# EAGLE board fmcboard_v1.6 (EAGLE 9.6.2), part 1 of 2
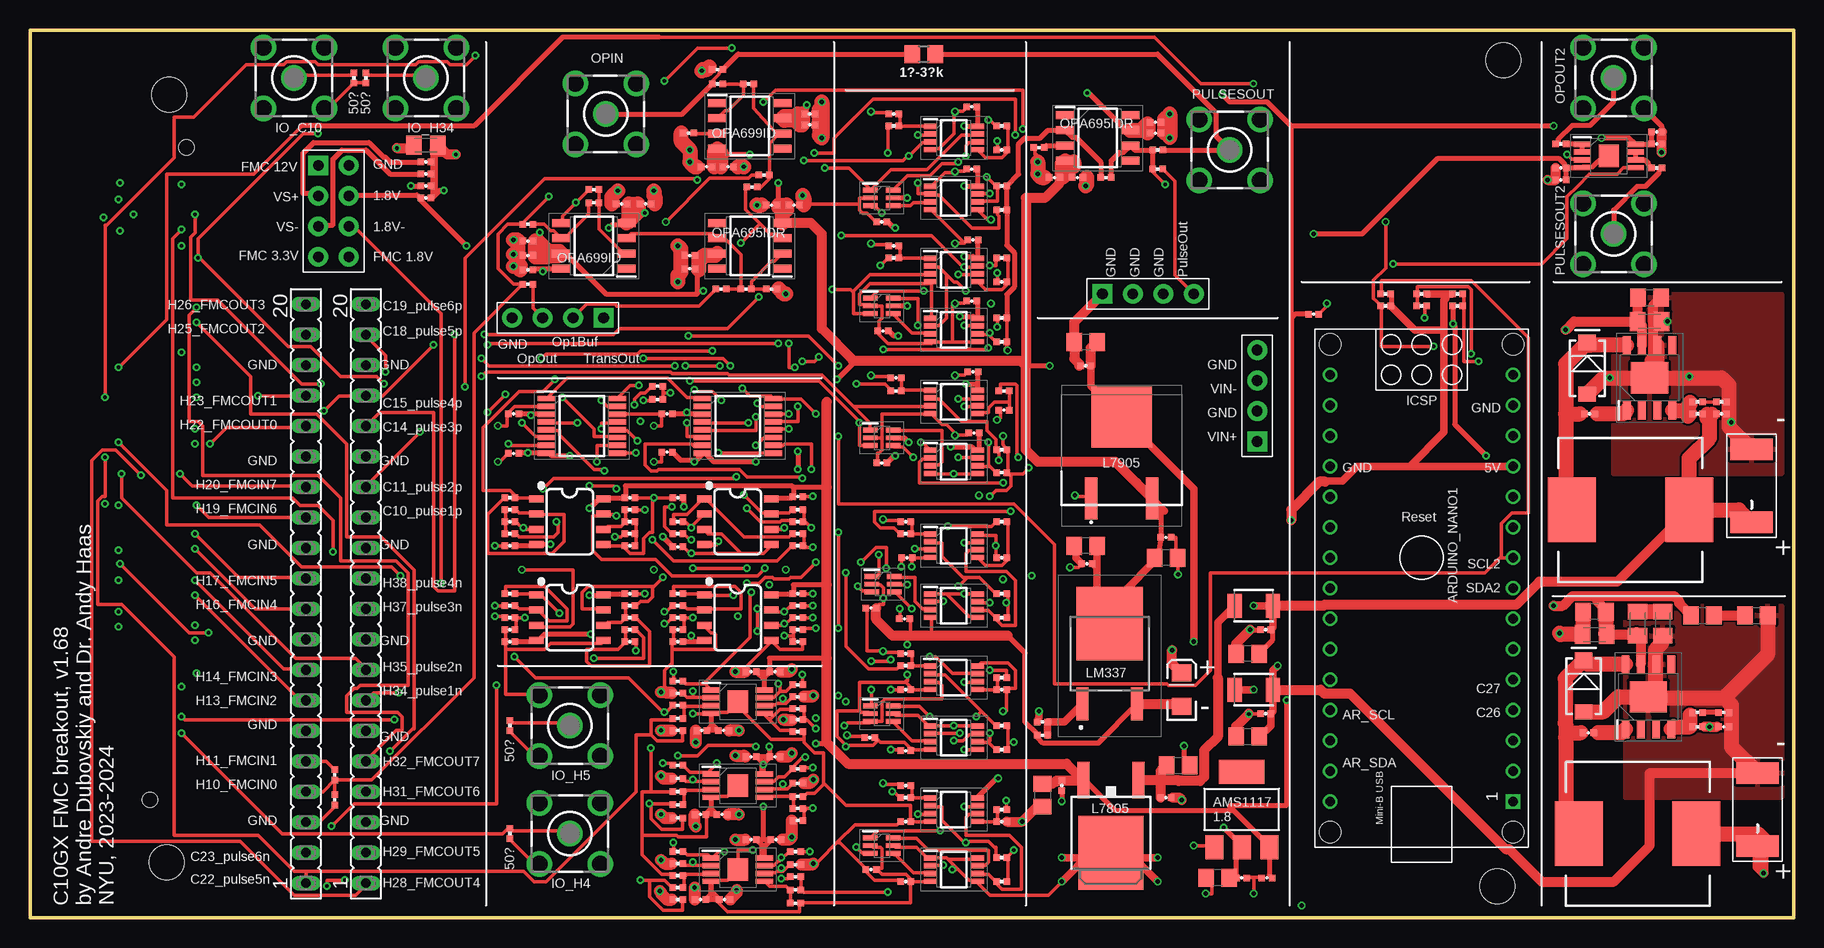
[diagram p5: board, top side]
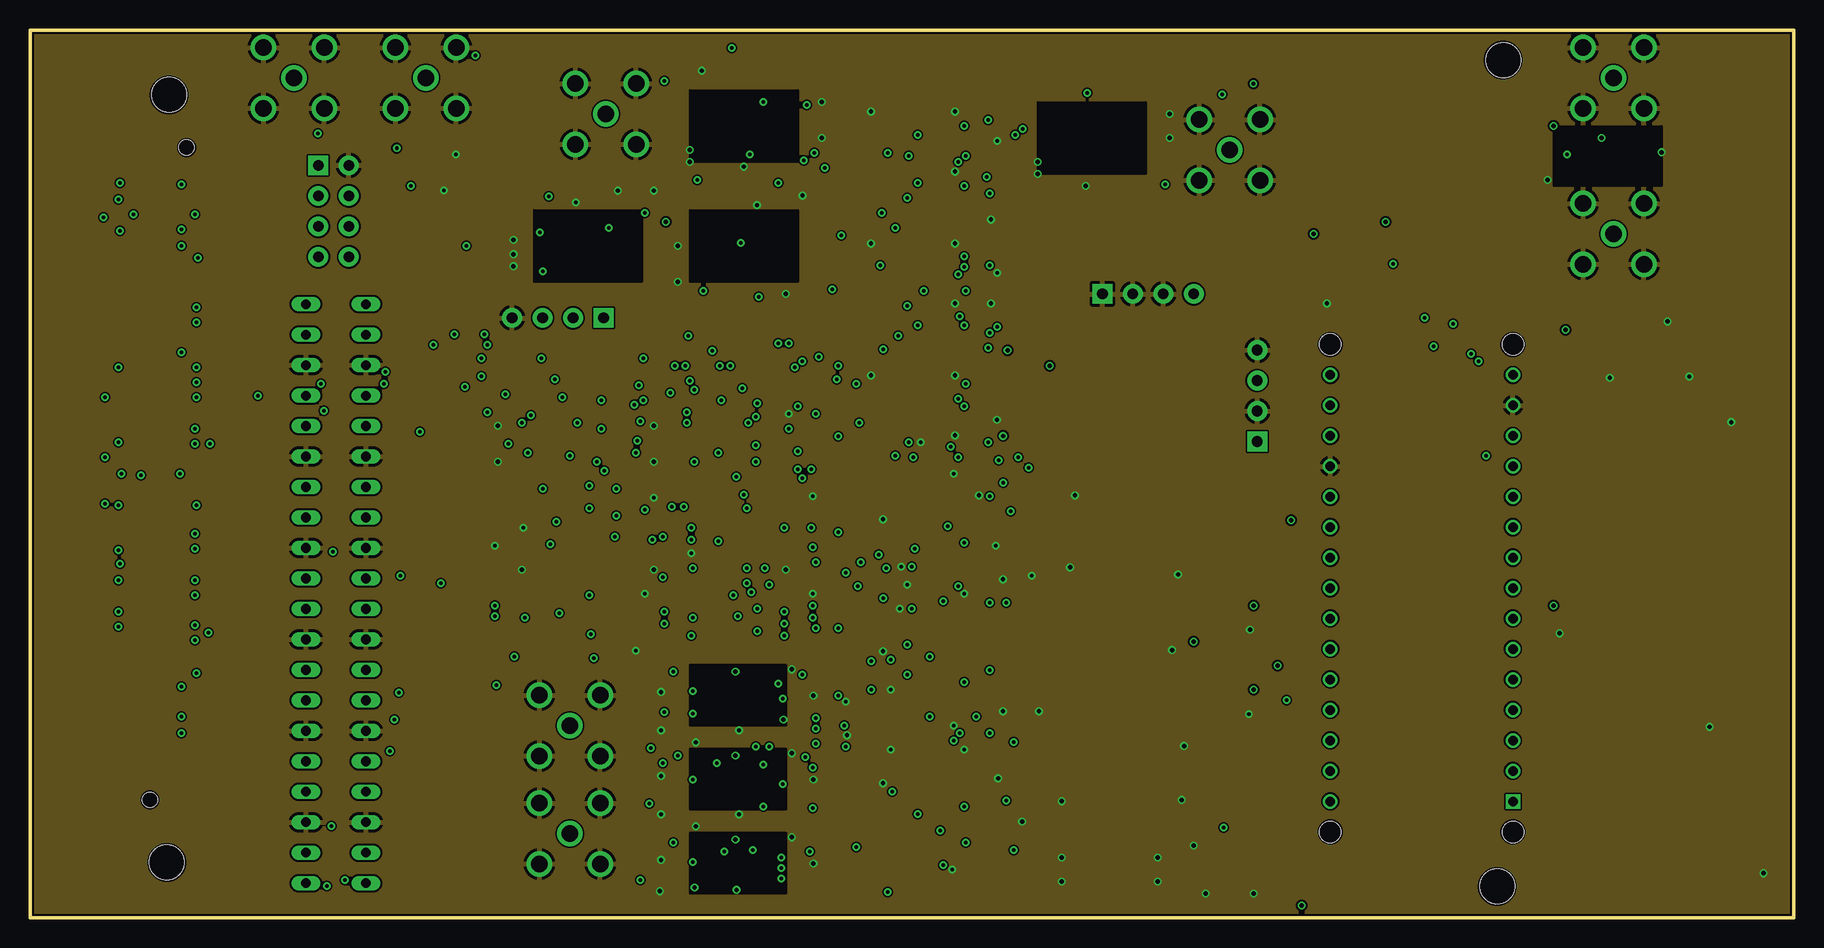
[diagram p6: board, inner layer topgnd]
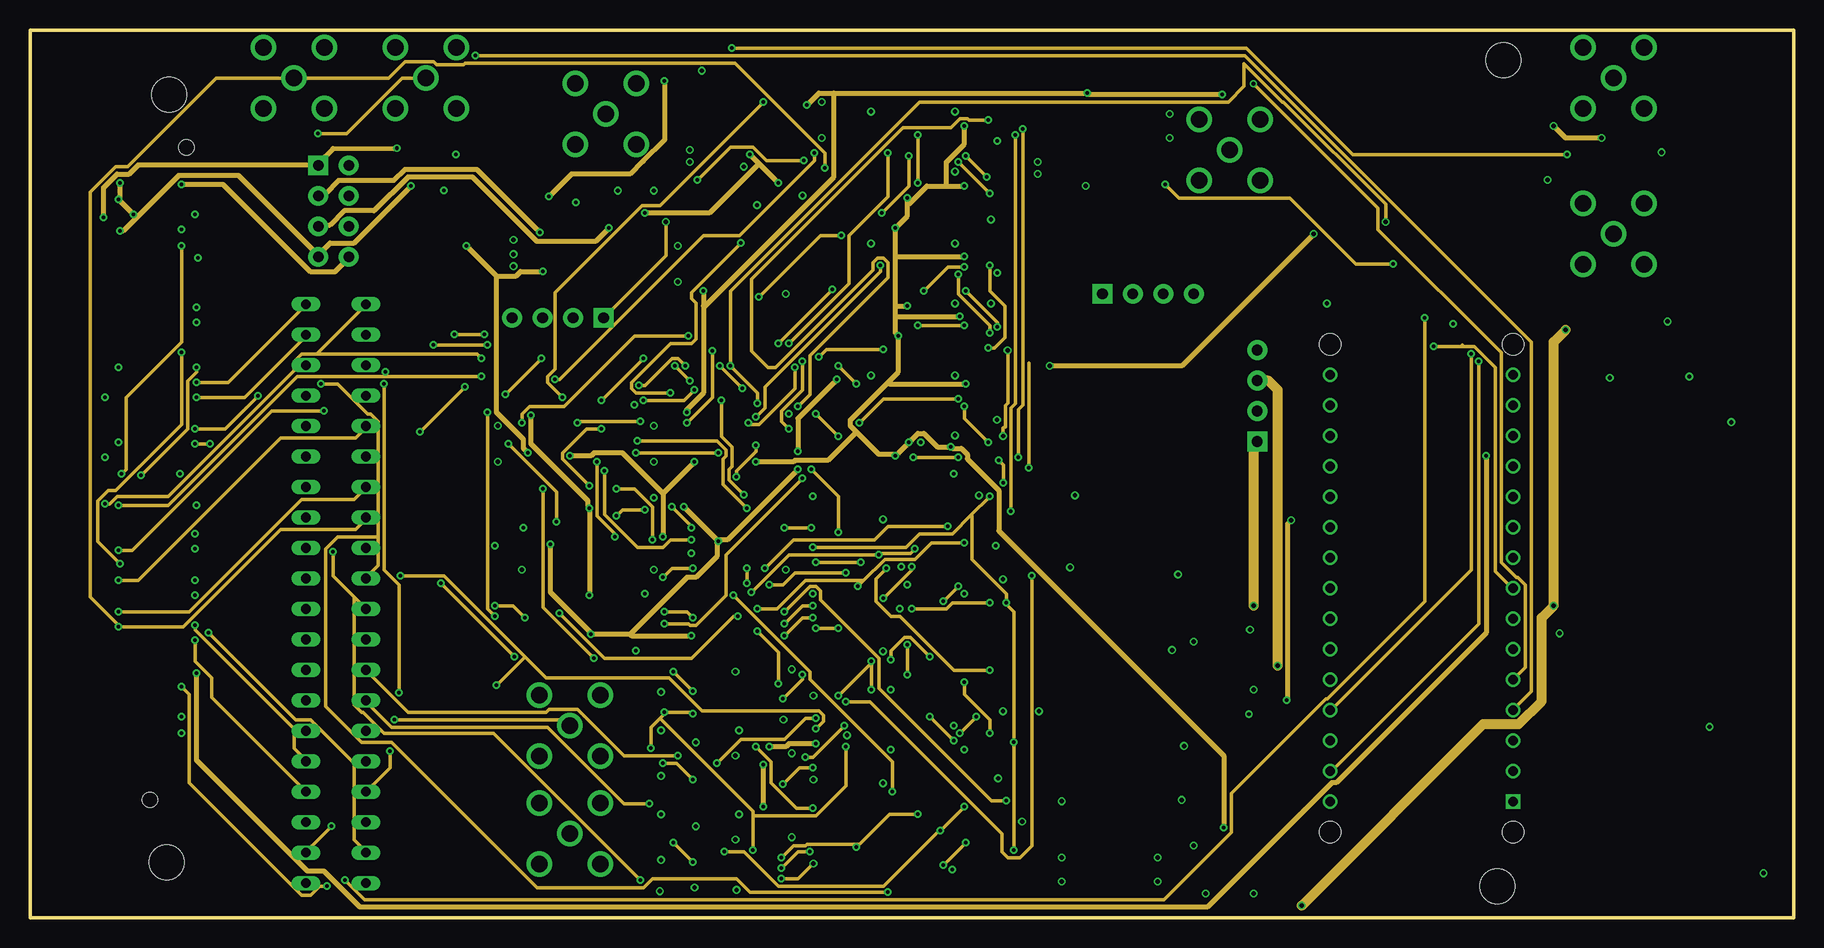
[diagram p7: board, inner layer route]
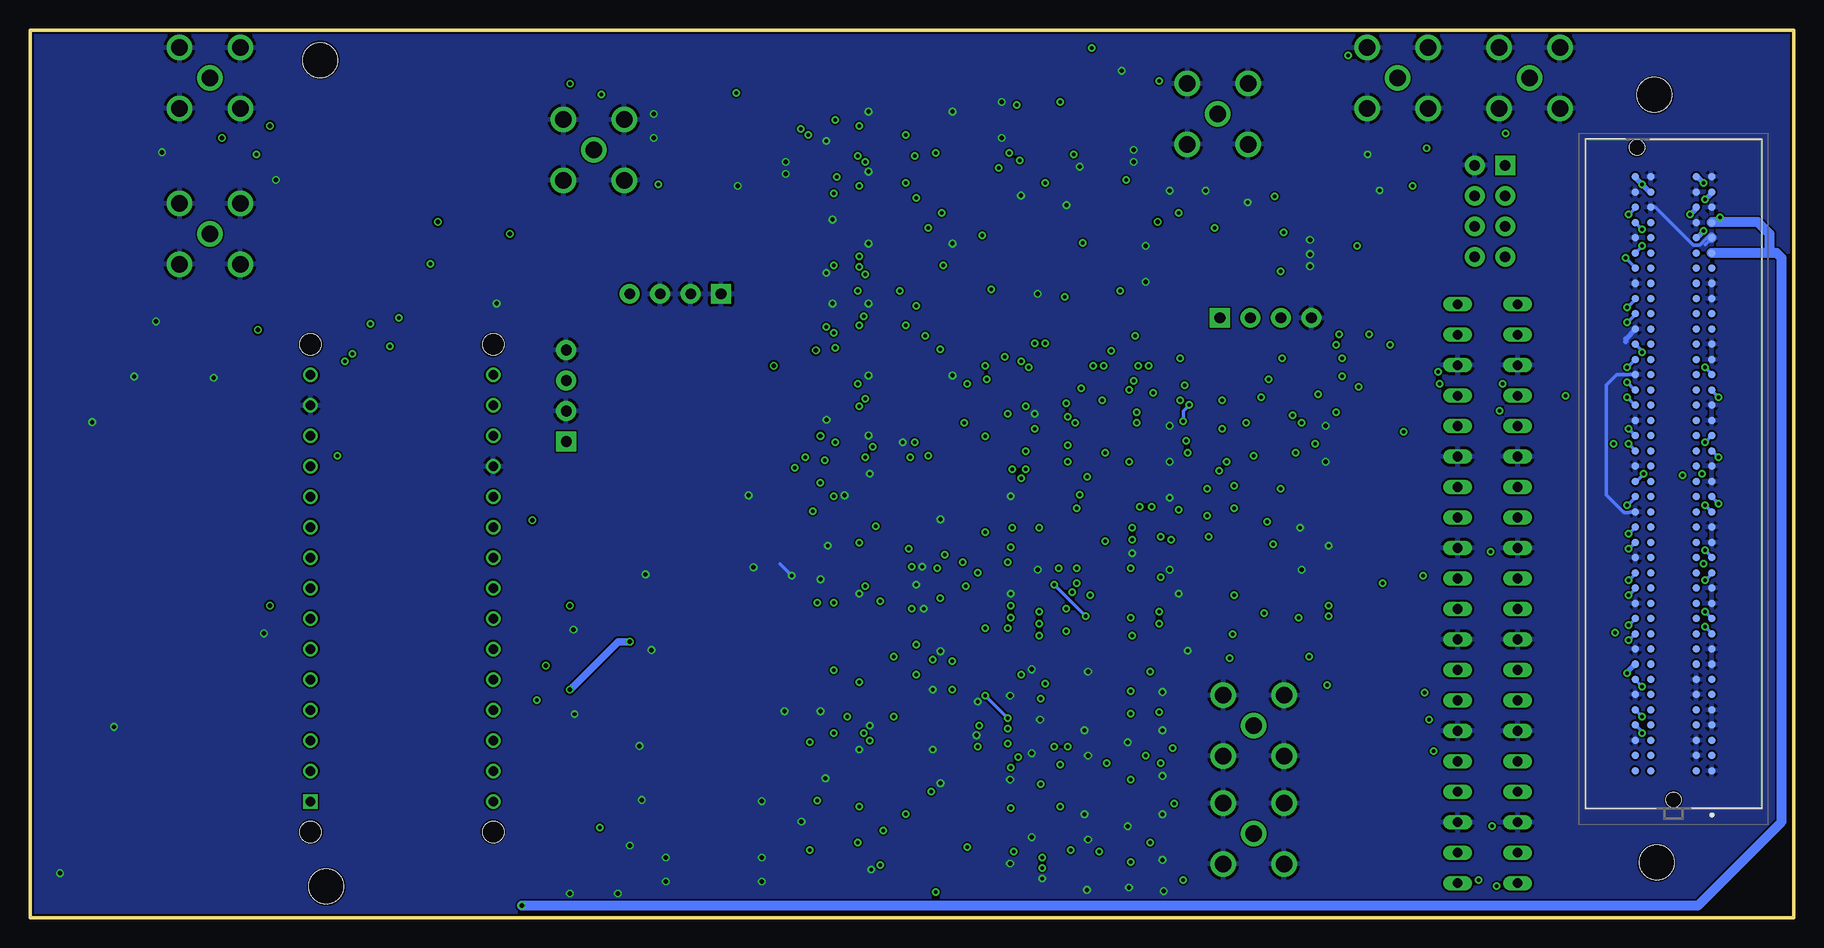
[diagram p8: board, bottom side, seen from below]

Size 147 x 74 mm. Coordinates in mm from the lower left corner, seen from the top.
Outline: 0,74 0,0 147,0 147,74 0,74
Copper layers (1*2*15*16): top 0.035mm / dielectric 0.2mm / topgnd 0.0175mm / dielectric 0.3mm / route 0.0175mm / dielectric 0.2mm / gnd 0.035mm
Design rules "Seeed_AllPCB_MacroFab_haas6mil *": minimum track width 6mil, minimum drill 12mil, track to track 6mil, track to pad 6mil, pad to pad 6mil, via to via 6mil, smd to smd 0mil, copper to edge 6mil, drill to drill 6mil, minimum pad ring 6mil, minimum via ring 6mil, stop-mask expansion 6mil, vias tented up to drill 25mil, thermal gap 10mil
Net classes: 0 default: width 0.305 mm; 1 power: width 0.406 mm; 2 gnd: width 0.305 mm
Holes 2.9 mm at 11.4,4.6 122.8,71.5 11.6,68.6 122.3,2.6

## Footprints (pad centres in the part's own frame; a part is rotated, then mirrored left to right if it is on the bottom)
ARDUINO_NANO = drill 0.8 square: 1 -20.32,-7.62 | drill 0.8: 2 -17.78,-7.62; 3 -15.24,-7.62; 4 -12.7,-7.62; 5 -10.16,-7.62; 6 -7.62,-7.62; 7 -5.08,-7.62; 8 -2.54,-7.62; 9 0,-7.62; 10 2.54,-7.62; 11 5.08,-7.62; 12 7.62,-7.62; 13 10.16,-7.62; 14 12.7,-7.62; 15 15.24,-7.62; 16 15.24,7.62; 17 12.7,7.62; 18 10.16,7.62; 19 7.62,7.62; 20 5.08,7.62; 21 2.54,7.62; 22 0,7.62; 23 -2.54,7.62; 24 -5.08,7.62; 25 -7.62,7.62; 26 -10.16,7.62; 27 -12.7,7.62; 28 -15.24,7.62; 29 -17.78,7.62; 30 -20.32,7.62 | hole 1.778: -22.86,-7.62; -22.86,7.62; 17.78,7.62; 17.78,-7.62
C0805 = smd 1.3 x 1.5: 1 -0.95,0; 2 0.95,0
VISHAY_C = smd 3.556 x 1.778: + 0,3.048; - 0,-3.048
0402_CAP = smd 0.536 x 0.546: 1 -0.433,0; 2 0.433,0
C0805K = smd 1.3 x 1.6: 1 -1,0; 2 1,0
EIA3216 = smd 1.4 x 1.6: A 1.4,0; C -1.4,0
SMA-DIODE = smd 1.27 x 1.47: A -2.15,0; C 2.15,0
SOIC127P600X175-8N = smd 1.528 x 0.65: 1 -2.711,1.905; 2 -2.711,0.635; 3 -2.711,-0.635; 4 -2.711,-1.905; 5 2.711,-1.905; 6 2.711,-0.635; 7 2.711,0.635; 8 2.711,1.905
SOP65P640X120-16N = smd 1.475 x 0.45: 1 -2.938,2.275; 2 -2.938,1.625; 3 -2.938,0.975; 4 -2.938,0.325; 5 -2.938,-0.325; 6 -2.938,-0.975; 7 -2.938,-1.625; 8 -2.938,-2.275; 9 2.938,-2.275; 10 2.938,-1.625; 11 2.938,-0.975; 12 2.938,-0.325; 13 2.938,0.325; 14 2.938,0.975; 15 2.938,1.625; 16 2.938,2.275
SOP65P490X110-9N = smd 1.425 x 0.45: 1 -2.212,0.975; 2 -2.212,0.325; 3 -2.212,-0.325; 4 -2.212,-0.975; 5 2.212,-0.975; 6 2.212,-0.325; 7 2.212,0.325; 8 2.212,0.975 | smd 1.68 x 1.88: 9 0,0
SO08 = smd 0.6 x 1.2: 1 -1.905,-2.8; 2 -0.635,-2.8; 3 0.635,-2.8; 4 1.905,-2.8; 5 1.905,2.8; 6 0.635,2.8; 7 -0.635,2.8; 8 -1.905,2.8
TO252 = smd 1 x 3.048: 1 -2.28,-3.556; 2 2.28,-3.556 | smd 5.4 x 6.2: 3 0,2.5
SOP65P400X130-8N = smd 1.1 x 0.45: 1 -1.95,0.975; 2 -1.95,0.325; 3 -1.95,-0.325; 4 -1.95,-0.975; 5 1.95,-0.975; 6 1.95,-0.325; 7 1.95,0.325; 8 1.95,0.975
SOT65P210X110-6N = smd 1.2 x 0.4: 1 -0.95,0.65; 2 -0.95,0; 3 -0.95,-0.65; 4 0.95,-0.65; 5 0.95,0; 6 0.95,0.65
MC7905ACD2TR4G = smd 1.016 x 3.504: 1 -2.54,-4.064; 3 2.54,-4.064 | smd 5.08 x 5.08: 2 0,2.745
SOT223 = smd 1.499 x 2.007: 1 -2.261,-3.15; 2 0.025,-3.15; 3 2.311,-3.15 | smd 3.81 x 2.007: 4 0,3.15
LM337KVURG3 = smd 1 x 2.75: 1 -2.29,-4.2; 3 2.29,-4.2 | smd 5.55 x 6.15: 2 0,2.5
SOIC127P600X170-9N = smd 1.525 x 0.65: 1 -2.712,1.905; 2 -2.712,0.635; 3 -2.712,-0.635; 4 -2.712,-1.905; 5 2.712,-1.905; 6 2.712,-0.635; 7 2.712,0.635; 8 2.712,1.905 | smd 2.6 x 3.1: 9 0,0
BU-SMB-V = drill 1.4: 1 0,0; 2 -2.54,2.54; 3 2.54,2.54; 4 2.54,-2.54; 5 -2.54,-2.54
H4-2.54 = drill 0.889 pad 1.651 square: 1 0,3.81 | drill 0.889 pad 1.651: 2 0,1.27; 3 0,-1.27; 4 0,-3.81
ASP13460401 = smd 0.64 x 0.64: C1 24.765,3.175; C2 23.495,3.175; C3 22.225,3.175; C4 20.955,3.175; C5 19.685,3.175; C6 18.415,3.175; C7 17.145,3.175; C8 15.875,3.175; C9 14.605,3.175; C10 13.335,3.175; C11 12.065,3.175; C12 10.795,3.175; C13 9.525,3.175; C14 8.255,3.175; C15 6.985,3.175; C16 5.715,3.175; C17 4.445,3.175; C18 3.175,3.175; C19 1.905,3.175; C20 0.635,3.175; C21 -0.635,3.175; C22 -1.905,3.175; C23 -3.175,3.175; C24 -4.445,3.175; C25 -5.715,3.175; C26 -6.985,3.175; C27 -8.255,3.175; C28 -9.525,3.175; C29 -10.795,3.175; C30 -12.065,3.175; C31 -13.335,3.175; C32 -14.605,3.175; C33 -15.875,3.175; C34 -17.145,3.175; C35 -18.415,3.175; C36 -19.685,3.175; C37 -20.955,3.175; C38 -22.225,3.175; C39 -23.495,3.175; C40 -24.765,3.175; D1 24.765,1.905; D2 23.495,1.905; D3 22.225,1.905; D4 20.955,1.905; D5 19.685,1.905; D6 18.415,1.905; D7 17.145,1.905; D8 15.875,1.905; D9 14.605,1.905; D10 13.335,1.905; D11 12.065,1.905; D12 10.795,1.905; D13 9.525,1.905; D14 8.255,1.905; D15 6.985,1.905; D16 5.715,1.905; D17 4.445,1.905; D18 3.175,1.905; D19 1.905,1.905; D20 0.635,1.905; D21 -0.635,1.905; D22 -1.905,1.905; D23 -3.175,1.905; D24 -4.445,1.905; D25 -5.715,1.905; D26 -6.985,1.905; D27 -8.255,1.905; D28 -9.525,1.905; D29 -10.795,1.905; D30 -12.065,1.905; D31 -13.335,1.905; D32 -14.605,1.905; D33 -15.875,1.905; D34 -17.145,1.905; D35 -18.415,1.905; D36 -19.685,1.905; D37 -20.955,1.905; D38 -22.225,1.905; D39 -23.495,1.905; D40 -24.765,1.905; G1 24.765,-1.905; G2 23.495,-1.905; G3 22.225,-1.905; G4 20.955,-1.905; G5 19.685,-1.905; G6 18.415,-1.905; G7 17.145,-1.905; G8 15.875,-1.905; G9 14.605,-1.905; G10 13.335,-1.905; G11 12.065,-1.905; G12 10.795,-1.905; G13 9.525,-1.905; G14 8.255,-1.905; G15 6.985,-1.905; G16 5.715,-1.905; G17 4.445,-1.905; G18 3.175,-1.905; G19 1.905,-1.905; G20 0.635,-1.905; G21 -0.635,-1.905; G22 -1.905,-1.905; G23 -3.175,-1.905; G24 -4.445,-1.905; G25 -5.715,-1.905; G26 -6.985,-1.905; G27 -8.255,-1.905; G28 -9.525,-1.905; G29 -10.795,-1.905; G30 -12.065,-1.905; G31 -13.335,-1.905; G32 -14.605,-1.905; G33 -15.875,-1.905; G34 -17.145,-1.905; G35 -18.415,-1.905; G36 -19.685,-1.905; G37 -20.955,-1.905; G38 -22.225,-1.905; G39 -23.495,-1.905; G40 -24.765,-1.905; H1 24.765,-3.175; H2 23.495,-3.175; H3 22.225,-3.175; H4 20.955,-3.175; H5 19.685,-3.175; H6 18.415,-3.175; H7 17.145,-3.175; H8 15.875,-3.175; H9 14.605,-3.175; H10 13.335,-3.175; H11 12.065,-3.175; H12 10.795,-3.175; H13 9.525,-3.175; H14 8.255,-3.175; H15 6.985,-3.175; H16 5.715,-3.175; H17 4.445,-3.175; H18 3.175,-3.175; H19 1.905,-3.175; H20 0.635,-3.175; H21 -0.635,-3.175; H22 -1.905,-3.175; H23 -3.175,-3.175; H24 -4.445,-3.175; H25 -5.715,-3.175; H26 -6.985,-3.175; H27 -8.255,-3.175; H28 -9.525,-3.175; H29 -10.795,-3.175; H30 -12.065,-3.175; H31 -13.335,-3.175; H32 -14.605,-3.175; H33 -15.875,-3.175; H34 -17.145,-3.175; H35 -18.415,-3.175; H36 -19.685,-3.175; H37 -20.955,-3.175; H38 -22.225,-3.175; H39 -23.495,-3.175; H40 -24.765,-3.175 | hole 1.27: 27.189,0; -27.191,-3.05
H2X4-2.54 = drill 0.889 pad 1.651 square: 1 -1.27,3.81 | drill 0.889 pad 1.651: 2 -1.27,1.27; 3 -1.27,-1.27; 4 -1.27,-3.81; 5 1.27,-3.81; 6 1.27,-1.27; 7 1.27,1.27; 8 1.27,3.81
1210 = smd 1.2 x 2: 1 -1.6,0; 2 1.6,0
CDRH125 = smd 5.4 x 4: 1 0,4.9; 2 0,-4.9
0402_RES = smd 0.536 x 0.546: 1 -0.433,0; 2 0.433,0
R0805 = smd 1.3 x 1.5: 1 -0.95,0; 2 0.95,0
FE20 = drill 0.813 long: 1 -24.13,0; 2 -21.59,0; 3 -19.05,0; 4 -16.51,0; 5 -13.97,0; 6 -11.43,0; 7 -8.89,0; 8 -6.35,0; 9 -3.81,0; 10 -1.27,0; 11 1.27,0; 12 3.81,0; 13 6.35,0; 14 8.89,0; 15 11.43,0; 16 13.97,0; 17 16.51,0; 18 19.05,0; 19 21.59,0; 20 24.13,0

## Placement (x,y rotation side)
ARDUINO_NANO1  1  [ARDUINO_NANO]  116,30 90 top
C1  10uF  [C0805]  101.5,22 180 top
C2  100uF  [VISHAY_C]  143.5,36 180 top
C3  0.1uF  [0402_CAP]  103.1,3.3 180 top
C4  0.1uF  [0402_CAP]  62.1,20.5 0 top
C5  0.1uF  [0402_CAP]  33,60 0 top
C6  0.1uF  [0402_CAP]  107,50.3 0 top
C7  0.1uF  [0402_CAP]  41.5,54 180 top
C8  0.1uF  [C0805K]  135,49.7 0 top
C9  0.1uF  [0402_CAP]  40.3,42 180 top
C10  0.1uF  [0402_CAP]  33,62 0 top
C11  0.1uF  [C0805K]  130.4,23.6 180 top
C12  0.1uF  [C0805K]  33,64.4 0 top
C13  0.1uF  [0402_CAP]  33,61 0 top
C14  0.1uF  [0402_CAP]  53.1,38.8 180 top
C15  0.1uF  [0402_CAP]  54,35 180 top
C16  0.1uF  [0402_CAP]  93.8,66.3 0 top
C17  1uF  [0402_CAP]  73,22 0 top
C18  1uF  [0402_CAP]  81,19 180 top
C19  1uF  [0402_CAP]  73,11 0 top
C20  1uF  [0402_CAP]  81,8 180 top
C21  0.1uF  [0402_CAP]  40,23 180 top
C22  0.1uF  [0402_CAP]  62.1,13.4 0 top
C23  0.1uF  [0402_CAP]  57.9,1.5 0 top
C24  0.1uF  [0402_CAP]  62.2,6.5 0 top
C25  0.1uF  [0402_CAP]  94.7,31.7 0 top
C26  0.1uF  [0402_CAP]  55,54.1 180 top
C27  0.1uF  [0402_CAP]  61.8,59.4 180 top
C28  0.1uF  [0402_CAP]  41.5,56.4 180 top
C29  0.1uF  [0402_CAP]  49.3,59.5 180 top
C30  0.1uF  [0402_CAP]  70.1,25.8 180 top
C31  1uF  [0402_CAP]  81.2,42.3 180 top
C32  100pF  [0402_CAP]  93.8,65.4 0 top
C33  0.1uF  [0402_CAP]  88.1,29.5 180 top
C34  10uF  [C0805]  99,3.3 180 top
C35  0.1uF  [0402_CAP]  78.5,67.6 180 top
C36  0.1uF  [0402_CAP]  54,30.9 0 top
C37  0.1uF  [0402_CAP]  50,27 0 top
C38  10uF  [C0805]  84.4,10.2 270 top
C39  10uF  [C0805]  94.7,30 180 top
C40  100uF  [VISHAY_C]  144,9 180 top
C41  10uF  [C0805]  101.5,15.1 0 top
C42  0.1uF  [0402_CAP]  103,24 180 top
C43  0.1uF  [0402_CAP]  94.7,10 0 top
C44  0.1uF  [0402_CAP]  103,17 0 top
C45  0.1uF  [0402_CAP]  88,46 0 top
C46  0.1uF  [0402_CAP]  87.3,61.7 180 top
C47  0.1uF  [0402_CAP]  86,11 270 top
C48  0.1uF  [0402_CAP]  64,35.1 0 top
C49  0.1uF  [0402_CAP]  71.1,48.9 180 top
C50  0.1uF  [0402_CAP]  73,3 180 top
C51  0.1uF  [0402_CAP]  73,8 180 top
C52  0.1uF  [0402_CAP]  78.5,62.4 180 top
C53  0.1uF  [0402_CAP]  78.6,56.5 180 top
C54  0.1uF  [0402_CAP]  53.1,42 180 top
C55  0.1uF  [0402_CAP]  40.3,38.7 180 top
C56  1uF  [0402_CAP]  54,24 0 top
C57  1uF  [0402_CAP]  40,24 0 top
C58  1uF  [0402_CAP]  72,56 0 top
C59  1uF  [0402_CAP]  72,67 0 top
C60  1uF  [0402_CAP]  64,23 0 top
C61  1uF  [0402_CAP]  50,23 0 top
C62  1uF  [0402_CAP]  81,53 180 top
C63  1uF  [0402_CAP]  81,64 180 top
C64  10uF  [C0805]  135,51.7 0 top
C65  0.1uF  [0402_CAP]  135.6,65.5 0 top
C66  0.1uF  [0402_CAP]  73,13.9 180 top
C67  0.1uF  [0402_CAP]  73,19 180 top
C68  0.1uF  [0402_CAP]  71,58 180 top
C69  0.1uF  [0402_CAP]  78.5,51.4 180 top
C70  0.1uF  [0402_CAP]  70.1,4 180 top
C71  0.1uF  [0402_CAP]  70,15 180 top
C72  0.1uF  [0402_CAP]  55.9,8.6 180 top
C73  0.1uF  [0402_CAP]  64,27 0 top
C74  0.1uF  [0402_CAP]  101,3.3 0 top
C75  0.1uF  [0402_CAP]  33,63 0 top
C76  0.1uF  [0402_CAP]  54,23 180 top
C77  10uF  [C0805]  88,31 180 top
C78  0.1uF  [0402_CAP]  65,67 0 top
C79  0.1uF  [0402_CAP]  58.2,62.6 0 top
C80  10uF  [C0805]  130.4,25.5 180 top
C81  100pF  [0402_CAP]  63.7,59.4 0 top
C82  100pF  [0402_CAP]  55,55.2 180 top
C83  100pF  [0402_CAP]  56.4,62.6 180 top
C84  100pF  [0402_CAP]  65,66.1 0 top
C85  100pF  [0402_CAP]  85.4,61.7 180 top
C86  0.1uF  [0402_CAP]  127.6,61.5 180 top
C87  100pF  [0402_CAP]  41.5,55.2 180 top
C88  100pF  [0402_CAP]  51.3,59.5 0 top
C89  1uF  [0402_CAP]  50,31 180 top
C90  1uF  [0402_CAP]  72.2,45 180 top
C91  100pF  [0402_CAP]  60.1,6.5 180 top
C92  100pF  [0402_CAP]  55.9,1.5 180 top
C93  100pF  [0402_CAP]  60.1,13.4 180 top
C94  100pF  [0402_CAP]  57.7,8.6 0 top
C95  0.1uF  [0402_CAP]  57.8,15.6 0 top
C96  1uF  [0402_CAP]  40,33 0 top
C97  0.1uF  [0402_CAP]  50,35 0 top
C98  0.1uF  [0402_CAP]  40,31 180 top
C99  1uF  [0402_CAP]  73,33 0 top
C100  1uF  [0402_CAP]  81,30 0 top
C101  0.1uF  [0402_CAP]  73.1,30 180 top
C102  0.1uF  [0402_CAP]  78.6,45.5 180 top
C103  0.1uF  [0402_CAP]  78.7,40.4 180 top
C104  0.1uF  [0402_CAP]  72.9,24.9 180 top
C105  0.1uF  [0402_CAP]  71,37.9 180 top
C106  0.1uF  [0402_CAP]  141.2,15.9 0 top
C107  0.01uF  [0402_CAP]  129.9,15.4 180 top
C108  0.1uF  [C0805K]  134,24.5 90 top
C109  10uF  [C0805]  143.9,25.2 0 top
C110  10uF  [C0805]  95.7,12.7 0 top
C111  10uF  [C0805]  88,48 0 top
C112  10uF  [C0805]  139.4,25.2 0 top
C113  0.1uF  [C0805K]  136.1,24.5 270 top
C114  100pF  [0402_CAP]  135.6,64.5 0 top
C115  100pF  [0402_CAP]  127.6,62.5 180 top
C116  100pF  [0402_CAP]  60.1,20.5 180 top
C117  100pF  [0402_CAP]  56,15.6 180 top
C121  0.1uF  [0402_CAP]  141,42 0 top
C122  0.01uF  [0402_CAP]  130,42 180 top
C125  2.2uF  [EIA3216]  96,19 90 top
D1  B340A  [SMA-DIODE]  129.8,45.8 90 top
D2  B340A  [SMA-DIODE]  129.5,19.3 90 top
IC1  OPA699ID  [SOIC127P600X175-8N]  60,66 0 top
IC2  DAC7578SPWR  [SOP65P640X120-16N]  59,41 0 top
IC3  LTC6229IMS8E#TRPBF  [SOP65P490X110-9N]  59,11 0 top
IC4  OPA695IDR  [SOIC127P600X175-8N]  89,65 0 top
IC5  LTC6229IMS8E#TRPBF  [SOP65P490X110-9N]  59,4 0 top
IC6  OPA695IDR  [SOIC127P600X175-8N]  60,56 180 top
IC7  OPA699ID  [SOIC127P600X175-8N]  47,56 180 top
IC8  LM358  [SO08]  45,25 270 top
IC9  LM358  [SO08]  59,25 270 top
IC10  LM358  [SO08]  59,33 270 top
IC11  7805DT  [TO252]  90.1,7.9 180 top
IC12  SN74AUC2G66DCTR  [SOP65P400X130-8N]  77,65 0 top
IC13  SN74AUC2G66DCTR  [SOP65P400X130-8N]  77,54 0 top
IC14  SN74AUC2G66DCTR  [SOP65P400X130-8N]  77,20 0 top
IC15  SN74AUC2G66DCTR  [SOP65P400X130-8N]  77,9 0 top
IC16  DAC7578SPWR  [SOP65P640X120-16N]  46,41 0 top
IC17  SN74AUC2G66DCTR  [SOP65P400X130-8N]  77,60 0 top
IC18  SN74AUC2G66DCTR  [SOP65P400X130-8N]  77,49 0 top
IC19  SN74AUC2G66DCTR  [SOP65P400X130-8N]  77,15 0 top
IC20  SN74AUC2G66DCTR  [SOP65P400X130-8N]  77,4 0 top
IC21  74AUP2GU04GW  [SOT65P210X110-6N]  71,60 0 top
IC22  74AUP2GU04GW  [SOT65P210X110-6N]  71,17 0 top
IC23  74AUP2GU04GW  [SOT65P210X110-6N]  71,51 0 top
IC24  74AUP2GU04GW  [SOT65P210X110-6N]  71,6 0 top
IC25  MC7905ACD2TR4G  [MC7905ACD2TR4G]  91,39 0 top
IC26  AMS1117-1.8  [SOT223]  101,9 0 top
IC27  LM358  [SO08]  45,33 270 top
IC28  SN74AUC2G66DCTR  [SOP65P400X130-8N]  77,31 0 top
IC29  LM337KVURG3  [LM337KVURG3]  90,22 0 top
IC30  SN74AUC2G66DCTR  [SOP65P400X130-8N]  77,43 0 top
IC31  SN74AUC2G66DCTR  [SOP65P400X130-8N]  77,38 0 top
IC32  SN74AUC2G66DCTR  [SOP65P400X130-8N]  77,26 0 top
IC33  LTC6229IMS8E#TRPBF  [SOP65P490X110-9N]  59,18 0 top
IC34  74AUP2GU04GW  [SOT65P210X110-6N]  71,40 0 top
IC35  74AUP2GU04GW  [SOT65P210X110-6N]  71.1,27.8 0 top
IC36  TPS5430DDAR  [SOIC127P600X170-9N]  134.9,18.4 90 top
IC37  TPS5430DDAR  [SOIC127P600X170-9N]  135,45 90 top
IC38  LTC6229IMS8E#TRPBF  [SOP65P490X110-9N]  131.6,63.5 0 top
IO_C10  BU-SMB-V  [BU-SMB-V]  22,70 270 top
IO_H4  BU-SMB-V  [BU-SMB-V]  45,7 270 top
IO_H5  BU-SMB-V  [BU-SMB-V]  45,16 270 top
IO_H34  BU-SMB-V  [BU-SMB-V]  33,70 270 top
J1  4p-2.54  [H4-2.54]  102.3,43.5 180 top
J2  ASP-134604-01  [ASP13460401]  10,37 270 bottom
J3  2X4P-2.54  [H2X4-2.54]  25.3,58.9 0 top
J5  4p-2.54  [H4-2.54]  44,50 270 top
J13  4p-2.54  [H4-2.54]  93.2,52 90 top
L1  10uH  [1210]  102,26 180 top
L2  10uH  [1210]  102,19 180 top
L3  10uH  [CDRH125]  133.4,34 90 top
L4  10uH  [CDRH125]  134,7 90 top
OPIN  BU-SMB-V  [BU-SMB-V]  48,67 90 top
OPOUT2  BU-SMB-V  [BU-SMB-V]  132,70 0 top
PULSESOUT  BU-SMB-V  [BU-SMB-V]  100,64 0 top
PULSESOUT2  BU-SMB-V  [BU-SMB-V]  132,57 0 top
R1  470  [0402_RES]  89.7,61.7 0 top
R2  47  [0402_RES]  57.3,69.5 180 top
R3  10  [0402_RES]  54.9,65.4 180 top
R4  50?  [0402_RES]  27,70 90 top
R5  50?  [0402_RES]  28,70 90 top
R6  1k  [0402_RES]  47,59.6 180 top
R7  470  [0402_RES]  81,59 180 top
R8  470  [0402_RES]  81,50 180 top
R9  1?-3?k  [R0805]  74.5,72 0 top
R10  100  [0402_RES]  25.4,9.8 90 top
R11  1k  [0402_RES]  59.9,69.5 180 top
R12  470  [0402_RES]  81,16 180 top
R13  10  [0402_RES]  84.1,64.2 180 top
R14  100  [0402_RES]  84.4,15.2 0 top
R15  50?  [0402_RES]  40,7 90 top
R16  50?  [0402_RES]  40,16 90 top
R17  1k  [0402_RES]  64,33 180 top
R18  1k  [0402_RES]  59.7,52.4 180 top
R19  47  [0402_RES]  61.8,52.4 180 top
R20  47  [0402_RES]  60.2,60.9 0 top
R21  330  [0402_RES]  54,9.4 180 top
R22  330  [0402_RES]  54,10.5 180 top
R23  330  [0402_RES]  54,12.7 180 top
R24  330  [0402_RES]  54,11.6 180 top
R25  330  [0402_RES]  52.3,43.2 180 top
R26  100  [0402_RES]  47,60.7 0 top
R27  330  [0402_RES]  64,9.1 180 top
R28  330  [0402_RES]  64,10.1 180 top
R29  330  [0402_RES]  64,12.4 180 top
R30  330  [0402_RES]  64,11.2 180 top
R31  330  [0402_RES]  52.3,44.3 180 top
R32  470  [0402_RES]  81,5 180 top
R33  470  [0402_RES]  81,61 180 top
R34  47  [0402_RES]  94,64 0 top
R35  1k  [0402_RES]  54,33 180 top
R36  470  [0402_RES]  81,48 180 top
R37  330  [0402_RES]  54,2.5 180 top
R38  470  [0402_RES]  81,14 180 top
R39  330  [0402_RES]  54,3.5 180 top
R40  470  [0402_RES]  81,3 180 top
R41  330  [0402_RES]  54,5.5 180 top
R42  100  [0402_RES]  57.3,70.7 180 top
R43  330  [0402_RES]  54,4.5 180 top
R44  330  [0402_RES]  63.8,2.3 180 top
R45  330  [0402_RES]  63.8,1.2 180 top
R46  330  [0402_RES]  63.8,5.5 180 top
R47  100  [0402_RES]  72,66 0 top
R48  4.7k  [0402_RES]  113,51 180 top
R49  4.7k  [0402_RES]  113,52 180 top
R50  4.7k  [0402_RES]  119,52 0 top
R51  4.7k  [0402_RES]  116,52 180 top
R52  330  [0402_RES]  63.8,4.4 180 top
R53  100  [0402_RES]  72,55 0 top
R54  100  [0402_RES]  40,25 0 top
R55  100  [0402_RES]  54,25 0 top
R56  100  [0402_RES]  81,66 180 top
R57  100  [0402_RES]  81,55 180 top
R58  100  [0402_RES]  50,24 0 top
R59  100  [0402_RES]  64,24 0 top
R60  1k  [0402_RES]  139,43 180 top
R61  1k  [0402_RES]  54,32 0 top
R62  1k  [0402_RES]  50,26 0 top
R63  1k  [0402_RES]  40,27 0 top
R64  1k  [0402_RES]  40,26 180 top
R65  1k  [0402_RES]  50,25 0 top
R66  1k  [0402_RES]  64,26 180 top
R67  1k  [0402_RES]  54,27 0 top
R68  1k  [0402_RES]  54,26 180 top
R69  1k  [0402_RES]  64,25 0 top
R70  47  [0402_RES]  84.4,16.3 180 top
R71  10  [0402_RES]  94,62.4 180 top
R72  10  [0402_RES]  57.6,52.4 0 top
R73  10k  [0402_RES]  139,42 0 top
R74  100  [0402_RES]  73,21 180 top
R75  100  [0402_RES]  81,20 0 top
R76  100  [0402_RES]  73,10 180 top
R77  100  [0402_RES]  81,9 0 top
R78  10  [0402_RES]  25.4,11.9 270 top
R79  1k  [0402_RES]  64,31 180 top
R80  330  [0402_RES]  54,8.3 180 top
R81  330  [0402_RES]  64,8.1 180 top
R82  330  [0402_RES]  63.8,3.4 180 top
R83  330  [0402_RES]  54,1.5 180 top
R84  1k  [0402_RES]  141,43 180 top
R85  1k  [0402_RES]  64,32 180 top
R86  10  [0402_RES]  41.5,52.8 180 top
R87  4.7k  [0402_RES]  119,51 0 top
R88  10  [0402_RES]  41.5,57.8 0 top
R89  10  [0402_RES]  61.2,61.9 0 top
R90  4.7k  [0402_RES]  116,51 180 top
R91  330  [0402_RES]  54,16.6 180 top
R92  100  [0402_RES]  81.2,43.9 180 top
R93  100  [0402_RES]  50,32 180 top
R94  100  [0402_RES]  72.2,43.9 180 top
R95  100  [0402_RES]  40,32 0 top
R96  1k  [0402_RES]  50,34 0 top
R97  1k  [0402_RES]  40,35 0 top
R98  1k  [0402_RES]  40,34 180 top
R99  1k  [0402_RES]  50,33 0 top
R100  100  [0402_RES]  73,32 180 top
R101  100  [0402_RES]  81,33 180 top
R102  330  [0402_RES]  54,17.7 180 top
R103  330  [0402_RES]  54,19.7 180 top
R104  330  [0402_RES]  54,18.7 180 top
R105  330  [0402_RES]  64,17.4 180 top
R106  330  [0402_RES]  64,15.5 180 top
R107  330  [0402_RES]  64,19.4 180 top
R108  330  [0402_RES]  64,18.4 180 top
R109  330  [0402_RES]  54,15.6 180 top
R110  330  [0402_RES]  64,16.5 180 top
R111  470  [0402_RES]  81,39 180 top
R112  470  [0402_RES]  81,27 180 top
R113  470  [0402_RES]  81,37.1 180 top
R114  470  [0402_RES]  81,25 180 top
R115  1k  [0402_RES]  64,34 180 top
R116  1k  [0402_RES]  139,17.1 180 top
R117  1k  [0402_RES]  141.2,17.1 180 top
R118  10k  [0402_RES]  139,15.9 0 top
R119  47  [0402_RES]  127.6,64.5 180 top
R120  47  [0402_RES]  135.6,62.5 180 top
SV1  20  [FE20]  23,27 90 top
SV2  20  [FE20]  28,27 90 top

## Tracks (layer width: path | path; a pad name or v marks a point on that pad's centre or on a via)
1V8  (via drill 0.3)
  top 0.406: C7.1 42.03,54.09 42.75,54.09 | 42.75,54.09 IC7.8 | C34.1 C74.1 100.57,5.39 IC26.2 101,6 v99.5,7.5 | v42.75,53.88 42.75,54.09 | v36.38,56 32.5,59.88 C5.1 32.5,60 32.25,60.25 26.65,60.25 J3.7 | C55.1 40.75,38.75 v41.5,38.75 43,38.75 IC16.8 43.25,38.75 43.5,38.5 v45,38.5 | v52.75,31.75 53.5,31 C36.1 | C14.1 53.62,38.75 54.25,38.12 55.25,38.12 v55.38,38 56,38.62 IC2.8 56.25,38.75 57,38 v60.5,38 | C35.1 79,67.5 79,66 IC12.8 78.75,66 v77.88,66 | C53.1 79,56.5 79,55 IC13.8 78.75,55 78.62,55.12 v77.88,55.12 | 79,44.5 79,44 IC30.8 | 79,44.5 79,45.5 C102.1 | C52.1 79,62.38 79,61 IC17.8 78.75,61 v77.88,61 | C69.1 79,51.38 79,50 IC18.8 78.75,50 78.62,50.12 v77.5,50.12 | C103.1 79.12,40.38 79.12,39 79,39 IC31.8 78.75,39 78.5,39.25 v76.75,39.25 | v72.12,38.5 72,38.5 71.5,38 C105.1 | v73.25,39.62 72.88,40 IC34.5 | v72.38,48.5 72,48.5 71.62,48.88 C49.1 | v72.12,57.5 72,57.5 71.5,58 C68.1 | v73.12,51 IC23.5 | v73.12,60 IC21.5 | v78,44.5 79,44.5
  route 0.406: v42.75,53.88 40.88,53.88 40.5,53.5 38.88,53.5 | v36.38,56 38.88,53.5 | 52.75,35.38 v52.75,31.75 | v55.38,38 52.75,35.38 | v45,38.5 46.75,38.5 47,38.75 49.38,38.75 52.75,35.38 | 71.5,44.62 68.38,41.5 68.38,41 68.88,40.5 | 71.5,44.62 72.38,45.5 v72.38,48.5 72.12,48.75 72.12,50.12 | 68.88,40.5 70.75,38.62 72,38.62 v72.12,38.5 v73.25,39.62 74,40.38 74.5,40.38 75.62,39.25 v76.75,39.25 76.88,39.12 77.62,39.12 78.12,38.62 78.12,38.25 80.75,35.62 80.75,32.25 99.5,13.5 v99.5,7.5 | 72.12,50.12 72.12,51 | 72.12,51 72.12,55.12 | 72.12,55.12 v72.12,57.5 73.12,58.5 73.12,59.5 | 72.12,51 v73.12,51 | 73.12,59.5 v73.12,60 | 72.12,50.12 v77.5,50.12 | 76.38,61 74.75,61 73.25,59.5 73.12,59.5 | 76.38,61 v77.88,61 | v78,44.5 71.62,44.5 71.5,44.62 | 72.12,55.12 v77.88,55.12 | v77.88,66 77.88,64.5 76.38,63 76.38,61 | v60.5,38 63.62,38 63.75,38.12 66.5,38.12 68.88,40.5 | 38.88,53.5 38.88,42.12 41.12,39.88 41.12,39.12 v41.5,38.75
1V8-  (via drill 0.3)
  top 0.305: IC28.4 75,30 C101.1 73.5,29.88 v73.5,29.25 | 73.38,23.5 73.38,24.88 C104.1 | 75.12,23.5 75.12,25 IC32.4 | IC35.2 70.25,27.75 70.88,27.75 71.12,27.5 v71.12,26.62 71.12,26.12 70.75,26.12 C30.1 | IC19.4 75,14 73.5,14 C66.1 73.5,14.12 73.38,14.12 72.88,14.62 70.88,14.62 70.5,15 C71.1 70.62,14.75 70.25,14.38 68,14.38 | IC14.4 75,19 C67.1 73.5,19.12 73,19.62 | 69.12,17.25 69.25,17.12 69.88,17.12 70,17 IC22.2 | 69.12,17.25 69.12,19.62 73,19.62 | 68,14.38 67.25,15.12 67.25,17.25 69.12,17.25 | v73.12,20.25 73.12,19.75 73,19.75 73,19.62 | v73.12,22.75 73.12,23.5 | C50.1 75,3 IC20.4 | C50.1 73.5,3.12 73,3.62 71,3.62 70.62,4 C70.1 70.62,4.12 71,4.12 71,5.75 70.88,5.88 70.25,5.88 70.12,6 IC24.2 | C23.1 57.25,1.38 58.12,0.5 64.12,0.5 64.12,1.12 R45.1 64.38,1.25 73.38,1.25 73.38,2.88 C50.1 | IC5.4 56.88,3.12 58.12,3.12 IC5.9 59,5.62 v60.25,5.62 | IC15.4 75,8 C51.1 73.38,8.12 73.38,9.38 68,9.38 66.25,11.12 66.12,11.12 | 66.12,11.12 65.38,10.38 64.75,10.38 64.5,10.12 R28.1 | 66.12,11.12 66.12,13.75 65.38,13.75 64.5,14.62 64.5,14.88 | 64.5,14.88 64.5,15.5 R106.1 | IC3.9 58.12,10.12 56.88,10.12 IC3.4 | 51,6.88 51,10.5 51.75,10.5 | 51,6.88 51,5.25 52.62,3.62 53.38,3.62 53.5,3.5 R39.2 | R22.2 51.75,10.5 | 51,6.88 53.88,6.88 54,6.75 56.38,6.75 56.38,8.5 C72.1 | v55.25,17 56.62,17 IC33.4 56.88,17.12 58.12,17.12 IC33.9 58.88,17.75 61.75,14.88 64.5,14.88 | R102.2 53.5,17.62 53,17.12 v52.88,17.12 52.75,17.12 49.88,20 42.12,20 v40.38,21.75 | 27,57.62 34.25,50.38 v34.25,27.88 | v51.75,14.12 51.75,10.5 | v68,14.25 68,14.38
  top 0.406: IC29.3 95.7,17.8 | IC29.3 89.03,14.54 84.45,14.54 83.97,15.02 R14.1 83.97,15.26 82.94,16.28 82.94,22.06 81.5,23.5 | 56.79,9.05 IC3.4 56.79,9.08 C94.1 | 56.79,9.05 56.37,8.63 | 56.37,8.63 C72.1 | C94.1 57.24,8.6 56.79,9.05 | C94.1 56.4,8.6 56.37,8.63 | 92.49,17.6 IC29.3 | J3.6 27,57.63 27,57.62 | IC33.4 56.79,15.96 C117.1 C95.1 56.79,16.18 IC33.4 | 56.79,1.96 IC5.4 56.79,2.18 C23.1 C92.1 56.79,1.96
  top 0.813: 81.5,23.5 75.12,23.5 73.38,23.5 73.12,23.5 71.9,23.5 70.53,24.87 C30.1 | IC29.3 95.8,17.8 C125.C
  route 0.305: v73.5,29.25 73.5,29 v71.12,26.62 | v73.12,20.25 v73.12,22.75 | v55.25,17 55.12,17.12 v52.88,17.12 52.88,17 52.5,16.62 | v40.38,21.75 v34.25,27.88 | v51.75,14.12 51.75,15.88 52.5,16.62 | 60.25,8.5 60.25,8.88 52.5,16.62 | 60.25,8.5 v60.25,5.62 | v68,14.25 68,11 65.5,8.5 60.25,8.5
1V8FMC  (via drill 0.3)
  route 0.406: v12.62,61.12 16.1,61.12 23.4,53.83 25.4,53.83 26.6,55.02 26.6,55.06 J3.5
  gnd 0.406: J2.G39 12,60.5 v12.62,61.12 13.12,61.62 13.12,61.75 J2.H40
3V3  (via drill 0.3)
  top 0.406: v31.75,61 C13.1
  route 0.406: v31.75,61 27,56.25 25,56.25 24,55.25 | v7.5,57.25 7.75,57.25 8.88,58.38 | 8.88,58.38 12.38,61.88 17.38,61.88 24,55.25 | 8.88,58.38 v8.62,58.62 v7.38,59.88 7.5,60 v7.5,61.25 | J3.4 24,55.12 24,55.25
  gnd 0.406: v7.5,57.25 8,56.75 J2.D36 | v8.62,58.62 8.12,59.12 J2.D38 | v7.38,59.88 6.88,60.38 J2.C39 | v7.5,61.25 8,61.75 J2.D40
12V  (via drill 0.3, 0.35)
  top 0.406: v30.57,64.15 31.73,64.12
  top 0.813: v30.57,64.15 31.75,64.15 C12.1 | C108.1 134.26,23.23 IC36.7 | IC37.7 134.37,49.34 C8.1 | C11.1 133.9,23.6 | v127,26 127.76,26 128.57,26.81 130.33,26.81 | 130.33,26.81 130.66,26.48 130.66,26.34 131.35,25.65 C80.1 | C112.1 137.46,26.19 137.46,26.38 137.03,26.81 130.33,26.81 | v128,49 128.7,49.7 C8.1 | C8.1 134,51.65 C64.1
  top 1.27: C80.1 131.35,23.65 C11.1 | 133.9,23.6 C108.1
  route 0.406: v30.57,64.15 25.25,64.12 24.06,62.94 | 24,62.88 24.06,62.94 | v6.12,58.38 6.12,60.88 7.25,62 8.25,62 9,62.75 23.88,62.75 23.91,62.71 J3.1 24.06,62.74 24.06,62.94
  route 0.813: v106,1 121.14,16.14 124.1,16.14 126,18.04 126,25 v127,26 127,48 v128,49
  gnd 0.406: v6.12,58.38 6.12,58
  gnd 0.813: v106,1 8,1 1,8 1,55 1.42,55.41 2,55.41 | 2,55.41 J2.C35 | 2,55.41 2,57 3,58 6.12,58 6.78,58 J2.C37
AR_SCLIN  (via drill 0.3)
  top 0.305: R90.2 115.62,51 115.62,52 R51.2 115.62,52.12 115.62,52.62 119.88,52.62 120.12,52.38 v120.12,47
  route 0.305: v120.12,47 120.12,29 108.5,17.38 ARDUINO_NANO1.27
AR_SCLIN2  (via drill 0.3)
  top 0.305: v50.75,44.38 50,44.38 49,43.38 IC16.16 | v57.5,46 v54.62,46 | v59.38,44.12 60,43.5 61.75,43.5 61.88,43.38 IC2.16 62,43.25 64.25,43.25 v65.5,42 | 122.62,30 122.62,32.88 123.5,33.75 124.88,33.75 124.88,48.38 120.12,53.12 112.62,53.12 112.62,52 R49.2 | ARDUINO_NANO1.9 122.62,30 | v67.38,40.12 67.38,34.5 82,34.5 85.38,31.12 85.38,19.5 94.75,19.5 94.88,19.38 97.12,19.38 98.38,20.62 98.38,28.75 121.25,28.75 122.5,30 122.62,30
  route 0.305: v50.75,44.38 51.25,44.38 53.5,46.62 54,46.62 v54.62,46 | v59.38,44.12 v57.5,46 | v67.38,40.12 v65.5,42
AR_SDAIN  (via drill 0.3)
  top 0.305: R50.2 119.5,52 119.5,51 R87.2 119.5,50.88 119.5,46.38 v120.75,46.38
  route 0.305: v120.75,46.38 120.75,24.5 108.5,12.25 ARDUINO_NANO1.29
AR_SDAIN2  (via drill 0.3, 0.35)
  top 0.305: IC16.15 48.12,42.62 v47.62,43.12 | v51.12,46.62 57.75,46.62 v58.38,46 | v60.62,42.88 60.88,42.62 IC2.15 | 112.62,51 112.62,47.62 v117,47.62 | 112.62,51 R48.2 | v113,58 113,54.15 111.99,53.14 111.99,51.6 112.17,51.42 112.2,51.42 112.62,51
  route 0.305: v51.12,46.62 v47.62,43.12 | v60.62,42.88 60.62,43.75 v58.38,46 58.38,52.25 74.12,68 99.9,68 101.2,69.3 101.2,71.2 104.4,68 104.48,68 113,59.48 v113,58 | 119.38,47.62 120.38,47.62 122.12,45.88 122.12,28.88 123.5,27.5 ARDUINO_NANO1.8 | 119.38,47.62 v117,47.62 | 119.38,47.75 119.38,47.62
BOOT1
  top 0.305: C122.1 130.62,42
  top 1.27: IC37.1 132.81,42 130.62,42
BOOT2
  top 0.305: C107.1 130.38,15.5 130.7,15.4
  top 1.27: IC36.1 132.71,15.4 130.7,15.4
C10  (via drill 0.3)
  top 0.305: IC12.7 78.88,65.25 77.62,65.25 74.75,62.38 71.75,62.38 70.12,60.75 IC21.1 70,60.75 68.25,62.5 v66.25,62.5 | IO_C10.1 22.25,70.25 26.88,70.25 27,70.38 R4.2
  route 0.305: SV2.13 28,33.25 27.12,32.38 20.88,32.38 12.75,24.25 v7.38,24.25 7.38,24.38 5,26.75 5,60.5 7.12,62.62 8.12,62.62 15.5,70 IO_C10.1 29.88,70 31.25,71.38 33.62,71.38 33.88,71.12 36.12,71.12 36.25,71.25 58.75,71.25 66.25,63.75 v66.25,62.5
  gnd 0.305: v7.38,24.25 6.88,23.75 J2.C10
C10N  (via drill 0.3)
  top 0.305: v80,60.38 79,60.38 IC17.7 | v77.38,63 77.25,62.88 76,62.88 75,61.88 73.12,61.88 72,60.75 IC21.6
  route 0.305: v77.38,63 v80,60.38
C11  (via drill 0.3)
  top 0.305: v71,58.75 70.5,59.25 70.12,59.25 IC21.3 | IC12.3 75,64.62 74.38,64.62 v73.25,63.5 73.12,63.5 72.75,63.12 v64.5,63.12 | v55.62,61.5 55.5,61.62 42.88,61.62 36.25,55 v36.25,44.25 | v32.5,40.5 28,36 SV2.14
  route 0.305: v73.25,63.5 73.25,61 v71,58.75 | v7.38,25.5 13.25,25.5 22.62,34.88 27,34.88 28,35.88 SV2.14 | v64.5,63.12 61.38,63.12 60.25,64.25 58.38,64.25 v55.62,61.5 | v32.5,40.5 v36.25,44.25
  gnd 0.305: v7.38,25.5 6.88,25 J2.C11
C11N
  top 0.305: IC17.3 75,59.62 73.62,59.62 73.38,59.38 72,59.38 IC21.4
C14  (via drill 0.3)
  top 0.305: v74.5,52.25 70.62,52.25 70.12,51.75 IC23.1 | IC13.7 78.88,54.25 v77.88,54.25 77.75,54.25 75.12,56.88 v67.62,56.88 | v60.75,51.75 58.12,49.12 49.12,49.12 48.62,48.62 v37.88,48.62 | v35.38,48.62 35.38,27.25 34,27.25 33.62,27.62 33.62,42.12 29.12,42.12 28,41 SV2.16
  route 0.305: v77.88,54.25 76.5,54.25 v74.5,52.25 | v7.38,28.12 9,28.12 20.88,40 27.12,40 28,40.88 SV2.16 | v67.62,56.88 65.88,56.88 v60.75,51.75 | v35.38,48.62 v37.88,48.62
  gnd 0.305: v7.38,28.12 6.88,28.62 J2.C14
C14N  (via drill 0.3)
  top 0.305: v77.88,49.38 78.88,49.38 IC18.7 | v74,49.38 74,51.62 72,51.62 IC23.6
  route 0.305: v74,49.38 v77.88,49.38
C15  (via drill 0.3)
  top 0.305: 68.62,52.25 70,53.62 75,53.62 IC13.3 | 68.62,52.25 68.62,50.38 70,50.38 IC23.3 | v24.5,42.25 25.75,43.5 SV2.17 28.12,43.5 29.38,43.5 v33.62,47.75 | v66.88,52.38 68.38,52.38 68.5,52.25 68.62,52.25 | v62.38,47.88 38.25,47.88 v38.12,47.75
  route 0.305: v7.38,30.62 8.5,30.62 20.12,42.25 v24.5,42.25 | v62.38,47.88 v66.88,52.38 | v33.62,47.75 v38.12,47.75
  gnd 0.305: v7.38,30.62 6.88,30.12 J2.C15
C15N
  top 0.305: IC18.3 75,48.75 73.5,48.75 72,50.25 IC23.4
C18  (via drill 0.3)
  top 0.305: v37.62,45.12 38,45.5 53.38,45.5 53.5,45.38 58.12,45.38 58.25,45.25 66,45.25 68.69,42.56 | 68.69,42.56 70,41.25 70,40.75 IC34.1 | IC30.3 75,42.62 68.75,42.62 68.69,42.56 | v29.62,45.5 29.62,46.88 28,48.5 SV2.19
  route 0.305: v7.38,34.38 11.5,34.38 22.25,45.12 29.62,45.12 | v37.62,45.12 29.62,45.12 | 29.62,45.12 v29.62,45.5
  gnd 0.305: v7.38,34.38 J2.C18
C18N
  top 0.305: IC31.3 75.12,37.75 75.75,37.75 76,38 76,40.62 72,40.62 IC34.6
C19  (via drill 0.3)
  top 0.305: v37.62,46.62 38.25,46 v53.75,46 | v55,44.75 65.75,44.75 69.12,41.38 v69.12,41.25 69.12,39.38 70,39.38 IC34.3 | v77.38,43.25 78.88,43.25 IC30.7
  route 0.305: v6.25,34.5 6.62,34.5 7.25,35.12 11.5,35.12 22,45.62 22,46.38 22.62,47 24,47 | 24,47 37.25,47 v37.62,46.62 | v55,44.75 v53.75,46 | v77.38,43.25 71.12,43.25 v69.12,41.25 | SV2.20 24,47.12 24,47
  gnd 0.305: v6.25,34.5 6.75,35 J2.C19
C19N  (via drill 0.3)
  top 0.305: v77.38,38.38 78.88,38.38 IC31.7 | v73.62,38.38 72.75,39.25 72,39.25 IC34.4
  route 0.305: v73.62,38.38 v77.38,38.38
C22  (via drill 0.3)
  top 0.305: 51.75,15.25 52.25,14.75 54.38,14.75 54.38,15.5 R109.1 | 51.75,15.25 51.75,16.5 53.5,16.5 R91.2 | v6.25,38.38 6.25,35.12 6,35.12 5.62,34.75 5.62,26.12 7.62,26.12 12,21.75 12,6.88 19,6.88 22,3.88 23,3.88 | 23,3.88 41.12,3.88 42,3 43,3 50.5,10.5 50.5,15.25 51.75,15.25 | 23,3.88 SV1.1
  gnd 0.305: v6.25,38.38 6.75,38.88 J2.C22
C22I  (via drill 0.3)
  top 0.305: 56.25,19.5 54.62,19.5 54.5,19.62 R103.1 | 56.25,19.5 56.75,19 IC33.1 | v73.75,30.75 75,30.75 IC28.3 | v70.75,30.25 70.75,28.5 70.25,28.5 IC35.1 | v60.12,27.12 60,27.12 60,23.38 56.25,19.62 56.25,19.5
  route 0.305: v73.75,30.75 73.38,30.38 70.88,30.38 v70.75,30.25 63.25,30.25 v60.12,27.12
C22N
  top 0.305: IC32.3 75,25.75 74.38,25.75 73.75,26.38 73.75,28.38 72.12,28.38 IC35.6
C23  (via drill 0.3)
  top 0.305: R105.1 64.5,17.38 64.5,16.5 R110.1 64.75,16.5 v65.5,15.75 | v7.38,39.62 11.38,35.62 11.38,32.75 19.12,32.75 22.62,29.25 30.12,29.25 v30.88,28.5 | v25.12,7.62 27,9.5 38.88,9.5 v38.88,19.38
  route 0.305: v30.88,28.5 34.5,28.5 41.25,21.75 | 41.25,21.75 43,20 53.25,20 56,17.25 65.75,17.25 66.12,16.88 66.12,16.38 v65.5,15.75 | v25.12,7.62 23,5.5 SV1.2 | 41.25,21.75 v38.88,19.38
  gnd 0.305: v7.38,39.62 J2.C23
C23I  (via drill 0.3)
  top 0.305: 62.5,18.88 63,18.88 63.5,19.38 R107.2 | 62.5,18.88 62,18.38 61.25,18.38 IC33.7 | v77.88,31.25 78.88,31.25 IC28.7 | v69,27.62 69.38,27.25 70.12,27.25 IC35.3 | 62.5,18.88 62.5,19.5 v62.38,19.5 | v60.62,25.75 v60.62,23.88
  route 0.305: v77.88,31.25 75.12,31.25 73.75,29.88 71.25,29.88 69.44,28.06 | v69,27.62 69.44,28.06 | v62.38,19.5 62.38,22.12 v60.62,23.88 | v60.62,25.75 62.25,25.75 64.62,28.12 69.38,28.12 69.44,28.06
C23N  (via drill 0.3)
  top 0.305: v80,26.25 79,26.25 IC32.7 | v73.5,25.75 72.12,27.12 IC35.4
  route 0.305: v80,26.25 76.88,26.25 76.38,25.75 v73.5,25.75
C26  (via drill 0.3)
  top 0.305: v6.25,43.38 6.25,57.75 6.38,57.75 12,63.38 12,66.75 13.62,66.75 18,71.12 21.12,71.12 21.38,71.38 23.75,71.38 24,71.12 32.12,71.12 32.38,71.38 34.75,71.38 35,71.12 36.38,71.12 v37.12,71.88
  route 0.305: v37.12,71.88 101.25,71.88 125.12,48 125.12,18.88 123.62,17.38 ARDUINO_NANO1.4
  gnd 0.305: v6.25,43.38 6.75,43.88 J2.C26
C27  (via drill 0.3)
  top 0.305: v7.38,45.88 11.38,49.88 11.38,62 18.62,62 22.62,66 | 52.4,73.4 93.72,73.4 97.6,69.53 v101.97,69.53
  top 0.406: 52.4,73.4 44.4,73.4 37,66 24.31,66 24.27,66.03 22.66,66.03 22.62,66
  route 0.305: ARDUINO_NANO1.5 123.62,19.88 124.62,20.88 124.62,27.75 124,28.38 123.88,28.38 122.62,29.62 122.62,47.09 112.37,57.34 112.37,59.13 v101.97,69.53
  gnd 0.305: v7.38,45.88 6.88,45.38 J2.C27
DACCLR  (via drill 0.3)
  top 0.305: v50.5,38.75 49,38.75 IC16.9 | v57.38,38.75 61.88,38.75 IC2.9
  route 0.305: v57.38,38.75 v50.5,38.75
DACLDAC
  top 0.305: IC16.1 43.12,43.38 44.75,45 53.12,45 54.75,43.38 56,43.38 IC2.1
DACN1  (via drill 0.3)
  top 0.305: C57.2 40.5,24 40.5,25 R54.2 v41.25,25 | v38.75,26 R64.2
  route 0.305: v38.75,26 40.25,26 v41.25,25
DACN1I
  top 0.305: C17.2 73.5,22 73.5,21 R74.1 75,21 IC14.1
DACN2
  top 0.305: R58.1 49.62,24 49.62,23 C61.1 49.5,22.88 49,22.38 46.38,22.38 46.38,21.38 46.75,21 51.62,21 51.62,23.88 50.5,25 R65.2
DACN2I
  top 0.305: R75.1 80.62,20 80.62,19 C18.2 79,19 IC14.5
DACN3  (via drill 0.3)
  top 0.305: C56.2 54.5,24 54.5,25 R55.2 v55.25,25 | v52.88,25.5 53,25.5 53.5,26 R68.2
  route 0.305: v52.88,25.5 54.75,25.5 v55.25,25
DACN3I
  top 0.305: C19.2 73.5,11 73.5,10 R76.1 75,10 IC15.1
DACN4  (via drill 0.3)
  top 0.305: 63.62,23.5 63.62,24 R59.1 | 63.62,23.5 63.62,23 C60.1 | v65.25,25 R69.2 | 63.62,23.5 v62.88,23.5
  route 0.305: v65.25,25 64.38,25 v62.88,23.5
DACN4I
  top 0.305: R77.1 80.62,9 80.62,8 C20.2 79,8 IC15.5
DACN5
  top 0.305: R95.1 39.62,32 39.62,33 C96.1 39.62,33.12 39.62,34 R98.2
DACN5I
  top 0.305: C99.2 73.5,33 73.5,32 R100.1 75,32 IC28.1
DACN6
  top 0.305: C89.1 50.5,31 50.5,32 R93.1 50.5,32.12 50.5,33 R99.2
DACN6I
  top 0.305: R101.1 81.5,33 81.5,30 C100.2 81.5,29.88 81,29.38 79.62,29.38 79,30 IC28.5
DACOFFSETN  (via drill 0.3)
  top 0.305: v59.75,34.12 60.88,33 62.5,33 62.62,33.12 63.38,33.12 63.5,33 R17.2 | v50.62,39.75 49.75,40.62 49,40.62 IC16.12
  route 0.305: v59.75,34.12 57.75,36.12 57.75,38.25 58,38.5 58,39 57.25,39.75 v50.62,39.75
DACOFFSETNI  (via drill 0.3)
  top 0.305: R115.2 63.5,34 63.25,33.75 61.88,33.75 IC10.7 61.75,33.75 61,33.75 v59.5,35.25 | v51.12,43.12 51.75,43.12 R25.2 | v55.38,44 55.5,43.88 56.88,43.88 v57.62,43.12
  route 0.305: v51.12,43.12 54.5,43.12 v55.38,44 | v57.62,43.12 57.62,40.12 58.5,39.25 58.5,37.62 58.25,37.38 58.25,36.5 v59.5,35.25
DACOFFSETP  (via drill 0.3)
  top 0.305: v50.38,42.75 50.38,43.25 50.88,43.75 51.25,43.75 51.75,44.25 R31.2 | v45.62,41.25 43.12,41.25 IC16.4
  route 0.305: v50.88,41.38 45.75,41.38 v45.62,41.25
  gnd 0.305: v50.38,42.75 50.88,42.25 v50.88,41.38
DACP1
  top 0.305: C59.2 72.5,67 72.5,66 R47.2 75,66 IC12.1
DACP2
  top 0.305: R56.1 81.5,66 81.5,64 C63.1 81.5,63.88 81,63.38 79.62,63.38 79,64 IC12.5
DACP3
  top 0.305: C58.2 72.5,56 72.5,55 R53.2 75,55 IC13.1
DACP4
  top 0.305: R57.1 81.5,55 81.5,53 C62.1 81.5,52.88 81,52.38 79.62,52.38 79,53 IC13.5
DACP5
  top 0.305: C90.1 72.62,44 R94.1 72.75,44 75,44 IC30.1
DACP6
  top 0.305: 81.62,43 81.62,43.88 R92.1 | 81.62,43 81.62,42.38 C31.1 | 81.62,43 80.38,43 79.88,42.5 79.88,42.12 79,42.12 IC30.5
FB1
  top 0.305: R73.1 138.62,42 138.09,42.29 | R60.2 138.62,43 138.19,42.62
  top 1.27: IC37.4 138.09,42.29 138.38,42 138.19,41.81 138.19,42.62 138.38,42.81 138.38,42.94
FB2
  top 0.305: R118.1 138.62,16 138.38,15.9 | 138.38,16.88 138.5,17 R116.2
  top 1.27: IC36.4 137.02,15.9 138.38,15.9 138.38,16.88
GND  (via drill 0.3, 0.35)
  top 0.305: IC18.1 75.12,50 75.12,53 IC13.4 75,52.88 70,52.88 69.12,52 69.12,51.12 70,51.12 IC23.2 71,51 71,50 70.75,49.75 70.75,49 C49.2 70.62,48.75 71.5,47.88 75.12,47.88 IC18.4 75.12,48 76.88,48 | 76.88,48 78.88,48 IC18.5 | 76.56,4.81 76.38,5 75.12,5 IC20.1 75,5 74.75,5 73.88,5.88 72.12,5.88 72,6 IC24.5 | 76.56,4.81 78.25,3.12 78.88,3.12 IC20.5 79,2.88 80,1.88 84.88,1.88 v86,3 | IC20.8 78.88,4.88 76.62,4.88 76.56,4.81 | C15.2 v52,35 51.88,35 | 51.88,35 C97.2 | IC27.5 47.88,31 C89.2 49.5,30.88 50,30.38 51.12,30.38 51.12,31.62 51.62,32.12 51.88,32.12 51.88,35 | 59.12,30.38 61.12,30.38 61.75,31 IC10.5 | 59.12,30.38 v55.12,30.38 55,30.38 54.5,30.88 C36.2 | IC10.3 56.25,32.25 56.5,32 57.62,32 59.12,30.5 59.12,30.38 | IC19.8 78.88,16 v77,16 75.12,16 IC19.1 75,16 74.88,16 74,16.88 72.12,16.88 72,17 IC22.5 | 76.5,27 v77.88,27 78.88,27 IC32.8 | 76.5,27 75.12,27 IC32.1 | IC32.5 78.88,25.12 78.25,25.12 76.5,26.88 76.5,27 | R26.1 46.5,60.62 v45.5,59.62 44.38,58.5 44.38,58 IC7.5 | IC31.4 75.12,37 v77,37 78.88,37 IC31.5 | C100.1 80.5,30 v80.5,31 80.5,31.88 79,31.88 IC28.8 | C60.2 64.38,23 64.38,22.38 62.5,22.38 61.88,23 IC9.5 61.75,23 59.75,21 59.6,20.5 C116.2 59.75,20.5 | C5.2 33.5,60 33.5,61 C13.2 33.5,61.12 33.5,62 C10.2 33.5,62.12 33.5,63 C75.2 33.5,63.12 33.5,64 33.5,64.4 | C50.2 72.5,3 72.38,3.12 70.38,3.12 69.75,3.75 69.75,4 C70.2 69.62,4.12 67.5,6.25 67.38,6.25 67.31,6.31 | 71,40 71,39 70.75,38.75 70.62,38.75 70.62,38 C105.2 | IC34.2 71,40 | 69.12,59.5 69.12,60 IC21.2 | 69.12,59.5 69.12,59 69.38,58.75 69.75,58.75 70.5,58 C68.2 | 41.06,32.44 41.12,32.38 42.12,32.38 IC27.3
  top 0.305: 41.06,32.44 40.5,33 C96.2 | 102,3.38 102.62,3.38 C3.2 | 102,3.38 101.5,3.38 C74.2 | C25.2 95.5,31.7 95.5,30 C39.1 95.44,29.94 95.69,29.68 95.7,29.7 v95.7,28.6 | C56.1 53.62,24 53.62,23 C76.2 53.5,22.88 53.5,22.38 | R5.1 28,69.62 27,69.62 R4.1 26.88,69.5 24.88,67.5 24.62,67.5 IO_C10.3 | C57.1 39.62,24 39.62,23 C21.2 39.62,22.88 39.62,22.38 | 53.62,1.5 R83.2 53.51,1.5 | 55.5,1.5 C92.2 55.41,1.5 | R10.1 25.38,9.25 24.12,8 23,8 SV1.3 | R15.1 40,6.5 42,4.5 42.38,4.5 IO_H4.4 | R16.1 40,15.5 42,13.5 42.38,13.5 IO_H5.4 | 53.62,4.5 R43.2 53.51,4.5 | 58.4,1.5 C23.2 | R80.2 53.62,8.38 53.51,8.3 | C72.2 55.5,8.62 55.41,8.6 | C94.2 58.12,8.62 58.2,8.6 | 59.75,6.5 C91.2 59.6,6.5 | v62.62,3.25 63.12,3.25 63.25,3.38 R82.2 | R24.2 53.62,11.62 53.51,11.6 | R52.1 64.25,4.5 64.3,4.4 | C24.2 62.7,6.5 | R109.2 53.62,15.62 53.51,15.6 | C117.2 55.62,15.62 55.5,15.53 | v38.75,31 C98.2 | C95.2 58.25,15.62 58.3,15.6 | R104.2 53.62,18.75 53.44,18.77 | C93.2 59.75,13.5 59.6,13.4 | R81.2 63.62,8.12 63.5,8.03 | v50.5,22.25 50.5,23 C61.2 | v51.25,27 C37.2 | R30.1 64.5,11.25 64.5,11.2 | C22.2 62.62,13.5 62.62,13.4 | v39,38 39.12,38 39.75,38.62 C55.2 | R110.2 63.62,16.5 63.51,16.47 | 67.31,6.31 65.75,4.75 v65.3,4.5 | 67.31,6.31 68.75,7.75 72.25,7.75 72.5,8 C51.2 | v39,41 39.75,41 39.75,42 C9.2 39.88,42.12 40.38,42.62 IC16.2 | 62.62,20.5 C4.2 | R108.1 64.5,18.5 64.5,18.4 | C19.1 72.5,11 72.38,11.12 71.12,11.12 v71.1,11.2 | C71.2 69.5,15 69.38,15.12 68.12,15.12 v68.1,15.2 | v71.75,14 72.5,14 C66.2 | v65.25,27 C73.2 | v71.75,19 C67.2 | v52,38 52.62,38 52.62,38.75 C14.2 | C17.1 72.5,22 72.38,22.12 71.12,22.12 v71.1,22.2 71,22.25 69.75,22.25 69.75,25.75 C30.2
  top 0.305: v52,41 52.62,41 52.62,42 C54.2 49,42 IC16.14 | v72.5,25.75 72.5,25 C104.2 | 41.12,54 C7.2 40.88,54 | C87.2 41.12,55.25 40.7,55.2 | v65.25,35.12 64.5,35.12 C48.2 | C28.2 41.12,56.5 40.7,56.4 | v72.62,29.25 72.62,30 C101.2 | 81.5,8 C20.1 | v98,2 98.5,2 98.5,3.25 C34.2 | v81.1,17.2 81.12,17.25 81.38,17.25 81.38,19 C18.1 81.5,19.12 82.12,19.12 82.12,20.62 81.5,21.25 79.25,21.25 79,21 IC14.8 | C99.1 72.5,33 72.38,33.12 71.12,33.12 v71.1,33.2 | C26.2 54.62,54.12 54.24,53.77 | C82.2 54.62,55.25 54.24,55.25 | C29.2 48.5,59.5 | C88.2 52.1,59.5 | R19.1 62.25,52.5 62.42,52.4 | C103.2 78.25,40.38 78.12,40.25 77.12,40.25 v77.1,40.2 77.12,40.38 76.38,41.12 76,41.12 75.12,42 IC30.4 75,42 71,42 71,40 | C90.2 71.75,45 71.62,45.12 70.12,45.12 v70.1,45.2 | C83.2 56,62.62 55.6,62.6 | R3.2 54.5,65.5 54.28,65.4 | C102.2 78.12,45.5 77.88,45.25 77.12,45.25 v77.1,45.2 | C31.2 80.88,42.25 80.88,41.64 v80.6,41.5 | C79.2 58.62,62.62 59,62.6 | C27.2 61.38,59.5 61,59.4 | C81.2 64.12,59.5 64.5,59.5 69.12,59.5 | R42.2 56.88,70.75 56.63,70.93 | C69.2 78,51.38 77.88,51.25 77.12,51.25 v77.1,51.2 77,51.12 76.88,51.12 76.88,48 | C58.1 71.5,56 71.38,56.12 70.12,56.12 v70.1,56.2 | C84.2 65.5,66.12 65.8,66.12 | C78.2 65.5,67 65.8,66.47 | v80.62,53.75 80.62,53 C62.2 | 77.75,56.25 77.12,56.25 v77.1,56.2 | 77.75,56.25 77.88,56.25 78.12,56.5 C53.2 | C59.1 71.5,67 71.38,67.12 70.12,67.12 v70.1,67.2 | C52.2 78,62.38 77.88,62.25 77.12,62.25 v77.1,62.2 77,62.12 76.25,62.12 75.12,61 IC17.1 | C35.2 78,67.5 77.75,67.25 77.12,67.25 v77.1,67.2 77,67.12 77,65.38 75.75,64.12 75.12,64.12 IC12.4 | v80.62,64.75 80.62,64 C63.2 | C85.2 85,61.75 84.6,61.7
  top 0.305: R13.2 83.75,64.12 83.75,63.62 83.88,63.62 v84,63 | C46.1 87.75,61.75 88.1,61.7 | C32.2 94.25,65.5 94.6,65.5 | C16.2 94.25,66.38 94.6,66.6 | 39.62,22.38 39.62,18.62 42.38,18.62 IO_H5.5 | 53.5,22.38 53.5,21.12 53.38,21.12 52.88,20.62 52.88,19.25 53.02,18.77 | v86.7,29.2 87.4,29.2 87.64,29.44 C33.2 | v102,2 102,3.38 | 79,10 IC15.8 | v77.88,14 78.88,14 IC19.5 | v74.25,39.62 74.38,39.62 75,39 IC31.1 | IC17.4 75.12,59 77.75,56.38 77.75,56.25 | IC17.5 79,59 79.75,58.25 80,58.25 v80.1,58.2 | v41,29 45.25,29 45.25,24.5 45,24.25 42.25,24.25 IC8.3 | 39.62,22.38 42.88,22.38 43.38,22.88 47.62,22.88 47.75,23 IC8.5 | 53.5,22.38 57.12,22.38 57.12,23.62 57,23.75 56.75,23.75 56.25,24.25 IC9.3 | v73.12,27.75 72.12,27.75 IC35.5 | v63.25,42 62,42 IC2.14 | v41.12,32.5 41.06,32.44 | v97,6 98.5,6 98.62,5.88 IC26.1 | IC25.1 88.38,35 88.25,35.12 87.12,35.12 v87.1,35.2 | IC11.3 90.5,5 91,5 | 95.2,10 C43.2 | 101,22 C1.2 | R70.2 84,16.38 84,16.37 | v108.1,51.2 108.1,50.97 C6.2 | v101.6,16.95 101.6,17 C44.1 | 95.2,10.2 C43.2 | v96,9.8 95.33,9.8 C43.2 | C45.1 87.62,46 87.47,46.16 | 77.12,4 v76.88,4 | 138.38,6.75 L4.2 | C121.2 141.62,42 | R84.1 141.62,43 | 135.5,49.75 135.53,49.7
  top 0.406: v101.7,24 C42.2 | IC15.8 80.58,11.6 v80.7,11.6 | C47.2 v86,9.7 | C106.1 140.63,15.9 139.57,15.9 R118.2 | v35.5,63.62 33.88,63.62 33.5,64 | v34.5,60.62 34.12,60.62 33.75,60.25 | 33.75,60.25 33.5,60 | 33.75,64.08 33.75,60.25 | v96.2,14.3 96.2,13.15 C110.2 | OPOUT2.4 136,66 136,65.47 | C114.2 136.03,63.83 v136,63.8
  top 0.61: v94,5 92,5 | 92,5 91,5 v86,5 | v94,3 92,5 | v86,3 88.4,5.4 IC11.3 | C77.2 87.17,30.88 87.17,30 C33.2 | v84.1,17.2 84.1,16.64 84.07,16.62 84.07,16.44 84,16.37 83.97,16.33
  top 0.813: J13.1 87.05,49.66 C111.1 87.05,46.58 87.47,46.16 87.47,46 | C20.1 v82.7,8 83.95,9.25 C38.2 | v101.7,24 100.55,22.85 C1.2 | C41.1 100.55,15.95 101.6,17 | v96,9.8 95.8,10 95.23,10 | C40.+ 144,4.2 v144.5,3.7 144.5,5.5 145,6 | 140.63,15.9 v140,15.9 139.57,15.9 | v35.5,63.62 34.77,63.62 C12.2 | 135.95,45.95 IC37.9 135,46.47 135.33,46.8 135.33,51.08 C64.2 | v136,63.8 136,65.47 C65.2 | v126.5,61.5 C86.2 C115.2 | C125.A 95.2,21.2 v95.2,22.3
  top 1.016: v59.1,15.6 58.3,15.6 | v58.9,2.3 58.9,2.07 58.4,1.56 58.4,1.5 | v55.4,2.5 55.4,1.57 55.41,1.56 55.41,1.5 | v52.5,2.2 52.64,2.06 52.64,1.95 53.09,1.5 53.51,1.5 | v52.6,4.8 52.9,4.5 53.51,4.5 | v58.8,6.5 59.6,6.5 | 62.7,6.5 63.3,6.5 v63.5,6.7 63.5,8.03 63.51,8.04 63.51,8.1 | v65.3,4.5 65.2,4.4 64.3,4.4 | v65.3,11.5 65,11.2 64.5,11.2 | v59.1,8.6 58.2,8.6 | v55.5,7.6 55.41,7.7 55.41,8.6 | v52.6,8.6 52.9,8.3 53.51,8.3 | v52.6,11.8 52.8,11.6 53.51,11.6 | v63.5,13.7 63.2,13.4 62.62,13.4 62.59,13.4 | v58.8,13.5 59.51,13.5 59.6,13.4 | v55.5,14.6 55.5,15.53 55.51,15.54 55.51,15.6 | v52.6,15.6 53.51,15.6 | v62.8,16.5 62.99,16.5 63.02,16.47 63.51,16.47 | v65.3,18.5 65.2,18.4 64.5,18.4 | v63.5,20.7 63.3,20.5 62.62,20.5 62.59,20.5 | v58.8,20.5 59.6,20.5 | v52.6,18.8 52.99,18.8 53.02,18.77 53.44,18.77 53.51,18.7
  top 1.27: 94.6,65.4 94.6,65.5 94.6,66.6 v95,67 95,65.06 | 88.1,61.7 88.1,61.11 88,61.01 v88,61 | v84,63 v84,62 84.3,61.7 84.6,61.7 | v63,52 62.82,52 62.42,52.4 | v64.4,60.2 64.4,60.09 64.5,59.99 64.5,59.5 64.5,59.4 | v60.6,59.4 61,59.4 | v66,68 v66,65 65.8,65.2 65.8,66.12 65.8,66.47 66,66.67 v66,68 | v66,68 66,67.57 65.8,67.37 65.8,67 66,67.2 v66,68 | 55.6,62.6 55.4,62.6 v55,63 v55,64 54.28,64.72 54.28,65.4 | v56,70.6 56.1,70.7 56.4,70.7 56.63,70.93 | v59.5,62.6 59,62.6 | v54,53 54,53.53 54.24,53.77 54.24,55.25 54.24,55.76 v54,56 | v52,60.6 52,60.19 52.1,60.09 52.1,59.5 | v49,60.6 48.5,60.1 48.5,59.5 | v40.3,56.5 40.6,56.5 40.7,56.4 40.7,55.2 | v40.3,55.3 40.6,55.3 40.7,55.2 | v40.3,54.3 40.58,54.3 40.88,54 40.88,54.32 40.7,54.5 40.7,55.2 | D1.A 131.15,45 IC37.9 | IC37.9 135.63,45.63 IC37.6 | C2.- 141.62,40.93 141.62,42 141.62,43 141.62,44.38 141,45 IC37.9 | L4.2 144,7 145,6 | C80.2 129.45,23.65 C11.2 127.6,23.6 v127.5,23.7
  route 0.305: v62.62,3.25 64,3.25 65.25,4.5 v65.3,4.5 | v68,18 70,18 81,7 81,5.5 81.5,5 82.5,5 83.5,6 v83.5,28.5
  gnd 0.305: 7.38,56.12 6.88,56.62 J2.C36 | J2.H27 14.74,45.26 15.61,44.39 15.61,35.25 14.13,33.77 13.62,33.77 13.56,33.83 J2.H18 | 84.5,29.5 v83.5,28.5 | J2.C36 7.19,56.69 7.83,56.06 8.35,56.06 11.52,59.23 J2.G38
  gnd 0.406: J2.H30 14,48.24 14,48
  gnd 0.813: J2.C36
  other vias: 95,65 79.1,35.2 81.1,28.2 80.1,51.2 52,29 63,29 136.5,49.7 138.3,45.1 131.7,45 141.8,41.3
  pour gnd: 148,75 148,-2 -1,-2 -1,75
  pour topgnd: 149,77 149,-3 -4,-3 -4,77
  cutout topgnd: 55,21.1 63,21.1 63,16 55,16
  cutout topgnd: 55,69 64,69 64,63 55,63
  cutout topgnd: 55,14.1 63,14.1 63,9 55,9
  cutout topgnd: 55,7.1 63,7.1 63,2 55,2
  cutout topgnd: 55,59 64,59 64,53 55,53
  cutout topgnd: 42,59 51,59 51,53 42,53
  cutout topgnd: 84,68 93,68 93,62 84,62
  pour top: 146,37 132,37 132,52 146,52
  cutout topgnd: 127,66 136,66 136,61 127,61
H4  (via drill 0.3)
  top 0.305: IO_H4.1 44.75,7.25 40.12,7.25 40,7.38 R15.2 39.88,7.38 39.75,7.38 39.38,7 21,7 v12.62,15.38
  gnd 0.305: v12.62,15.38 12.62,15.5 13.12,16 J2.H4
H5  (via drill 0.3)
  top 0.305: IO_H5.1 44.75,16.25 40.12,16.25 40,16.38 R16.2 | v12.62,16.75 12.88,16.5 v30.38,16.5
  route 0.305: v30.38,16.5 44.5,16.5 IO_H5.1
  gnd 0.305: v12.62,16.75 13.12,17.25 J2.H5
H13  (via drill 0.3)
  top 0.305: v13.75,26.88 22.5,18.12 23,18.12 SV1.7
  gnd 0.305: v13.75,26.88 13.25,27.38 J2.H13
H14  (via drill 0.3)
  top 0.305: v13.75,28.12 21.12,20.75 23,20.75 SV1.8
  gnd 0.305: v13.75,28.12 13.25,28.62 J2.H14
H16  (via drill 0.3)
  top 0.305: v13.75,30.75 18.75,25.75 23,25.75 SV1.10
  gnd 0.305: v13.75,30.75 13.25,31.25 J2.H16
H17  (via drill 0.3)
  top 0.305: v13.75,32 17.38,28.38 23,28.38 SV1.11
  gnd 0.305: v13.75,32 13.25,32.5 J2.H17
H19  (via drill 0.3)
  top 0.305: v13.88,34.38 14.88,33.38 23,33.38 SV1.13
  gnd 0.305: v13.88,34.38 13.25,35 J2.H19
H20  (via drill 0.3)
  top 0.305: v12.5,37 13.5,36 23,36 SV1.14
  gnd 0.305: v12.5,37 13.12,36.38 J2.H20
H22  (via drill 0.3)
  top 0.305: v15,39.5 16.38,40.88 23,40.88 SV1.16
  route 0.305: v15,39.5 v13.75,39.5
  gnd 0.305: v13.75,39.5 13.25,39 J2.H22
H23  (via drill 0.3)
  top 0.305: v19,43.5 SV1.17
  route 0.305: v13.75,40.75 16.25,40.75 v19,43.5
  gnd 0.305: v13.75,40.75 J2.H23
H25  (via drill 0.3)
  route 0.305: v13.88,43.38 17.88,43.38 23,48.5 SV1.19
  gnd 0.305: v13.88,43.38 13.25,42.75 J2.H25
H26  (via drill 0.3)
  route 0.305: v13.88,44.62 16.5,44.62 SV1.20
  gnd 0.305: v13.88,44.62 13.25,44 J2.H26
H28  (via drill 0.3)
  top 0.305: v9.25,36.88 7.12,39 6,39 5.12,38.12 5.12,6.38 17.5,6.38 22,1.88 27.12,1.88 28,2.75 SV2.1
  route 0.305: v13.88,45.88 13.88,45.5 13.12,44.75 13.12,40.75 v9.25,36.88
  gnd 0.305: v13.88,45.88 13.25,46.5 J2.H28
H29  (via drill 0.3)
  top 0.305: v7.5,29.5 13.25,23.75 v14.88,23.75
  route 0.305: v12.62,47.12 12.62,41.12 7.12,35.62 6.5,35.62 5.62,34.75 5.62,31.38 v7.5,29.5 | v14.88,23.75 22.12,16.5 23.38,16.5 27,12.88 27,6.5 28,5.5 SV2.2
  gnd 0.305: v12.62,47.12 12.62,47.25 13.12,47.75 J2.H29
H31  (via drill 0.3)
  top 0.305: v13.88,49.62 18.38,45.12 18.38,42 23.88,42 26.38,39.5 26.38,31.75 29.25,31.75 32,29 32,15.75 31.88,15.75 v30,13.88
  route 0.305: v30,13.88 30,12.5 SV2.4
  gnd 0.305: v13.88,49.62 13.25,50.25 J2.H31
H32  (via drill 0.3)
  top 0.305: v13.88,50.88 13.25,50.25 13.25,41.38 14,41.38 14.38,41 14.38,36.88 24,36.88 25.88,35 25.88,29.75 30.5,29.75 31.5,28.75 31.5,19.38 27.5,19.38 27.25,19.12 27,19.12 26.38,18.5 26.38,17.12 30.62,17.12 31,16.75 31,15.62 30.5,15.62 28,13.12 SV2.5
  gnd 0.305: v13.88,50.88 13.25,51.5 J2.H32
H34  (via drill 0.3)
  top 0.305: 51.75,9.5 51.75,8.25 52.62,7.38 54.38,7.38 54.38,8.25 R80.1 | 51.75,9.5 53.5,9.5 R21.2 | v51.62,9.5 51.75,9.5 | IO_H34.1 32.75,70.25 28.12,70.25 28,70.38 R5.2 | v24,65.38 22.75,65.38 14,56.62 v14,55 14.12,55 21.5,47.62 23.38,47.62 25.88,45.12 28.88,45.12 v29.5,44.5 | v30.75,18.75 28.62,18.75 28,18.12 SV2.7
  route 0.305: v51.62,9.5 49.5,9.5 43.12,15.88 30.12,15.88 28,18 SV2.7 | v24,65.38 26.38,65.38 31,70 IO_H34.1 | v30.75,18.75 30.75,27.75 29.5,29 v29.5,44.5
  gnd 0.305: v14,55 13.25,54.25 J2.H34
H34I  (via drill 0.3)
  top 0.305: 56.62,12.12 55,12.12 54.5,12.62 R23.1 | 56.62,12.12 56.75,12 IC3.1 | v75,21.75 75.5,21.75 76.88,20.38 78.88,20.38 IC14.7 | v71.75,21.5 71.62,21.38 v70.12,21.38 | v70.12,19 70.12,17.75 IC22.1 | v57.25,12.88 56.62,12.25 56.62,12.12
  route 0.305: v75,21.75 73.38,23.38 72.88,23.38 71.75,22.25 v71.75,21.5 | v70.12,19 v70.12,21.38 70,21.12 v67.38,18.5 | v57.25,12.88 59.25,14.88 62.88,14.88 64.62,16.62 v65.5,16.62
  gnd 0.305: v67.38,18.5 v65.5,16.62
H34N  (via drill 0.3)
  top 0.305: v77,14.75 77.75,14.75 78.25,15.25 78.88,15.25 IC19.7 | v75,16.75 74.12,17.62 72,17.62 IC22.6
  route 0.305: v75,16.75 v77,14.75
H35  (via drill 0.3)
  top 0.305: R81.1 64.5,8.12 64.5,9 R27.1 64.62,9 64.75,9.12 v65.25,9.12 | v7.62,37 7.62,35 13.88,28.75 15,28.75 22.12,21.62 27.12,21.62 28,20.75 SV2.8 | v60.5,14.25 60.38,14.38 56.5,14.38 55.62,13.5 v54,13.5